# EAGLE design PQ60-EPS (EAGLE 7.2.0)
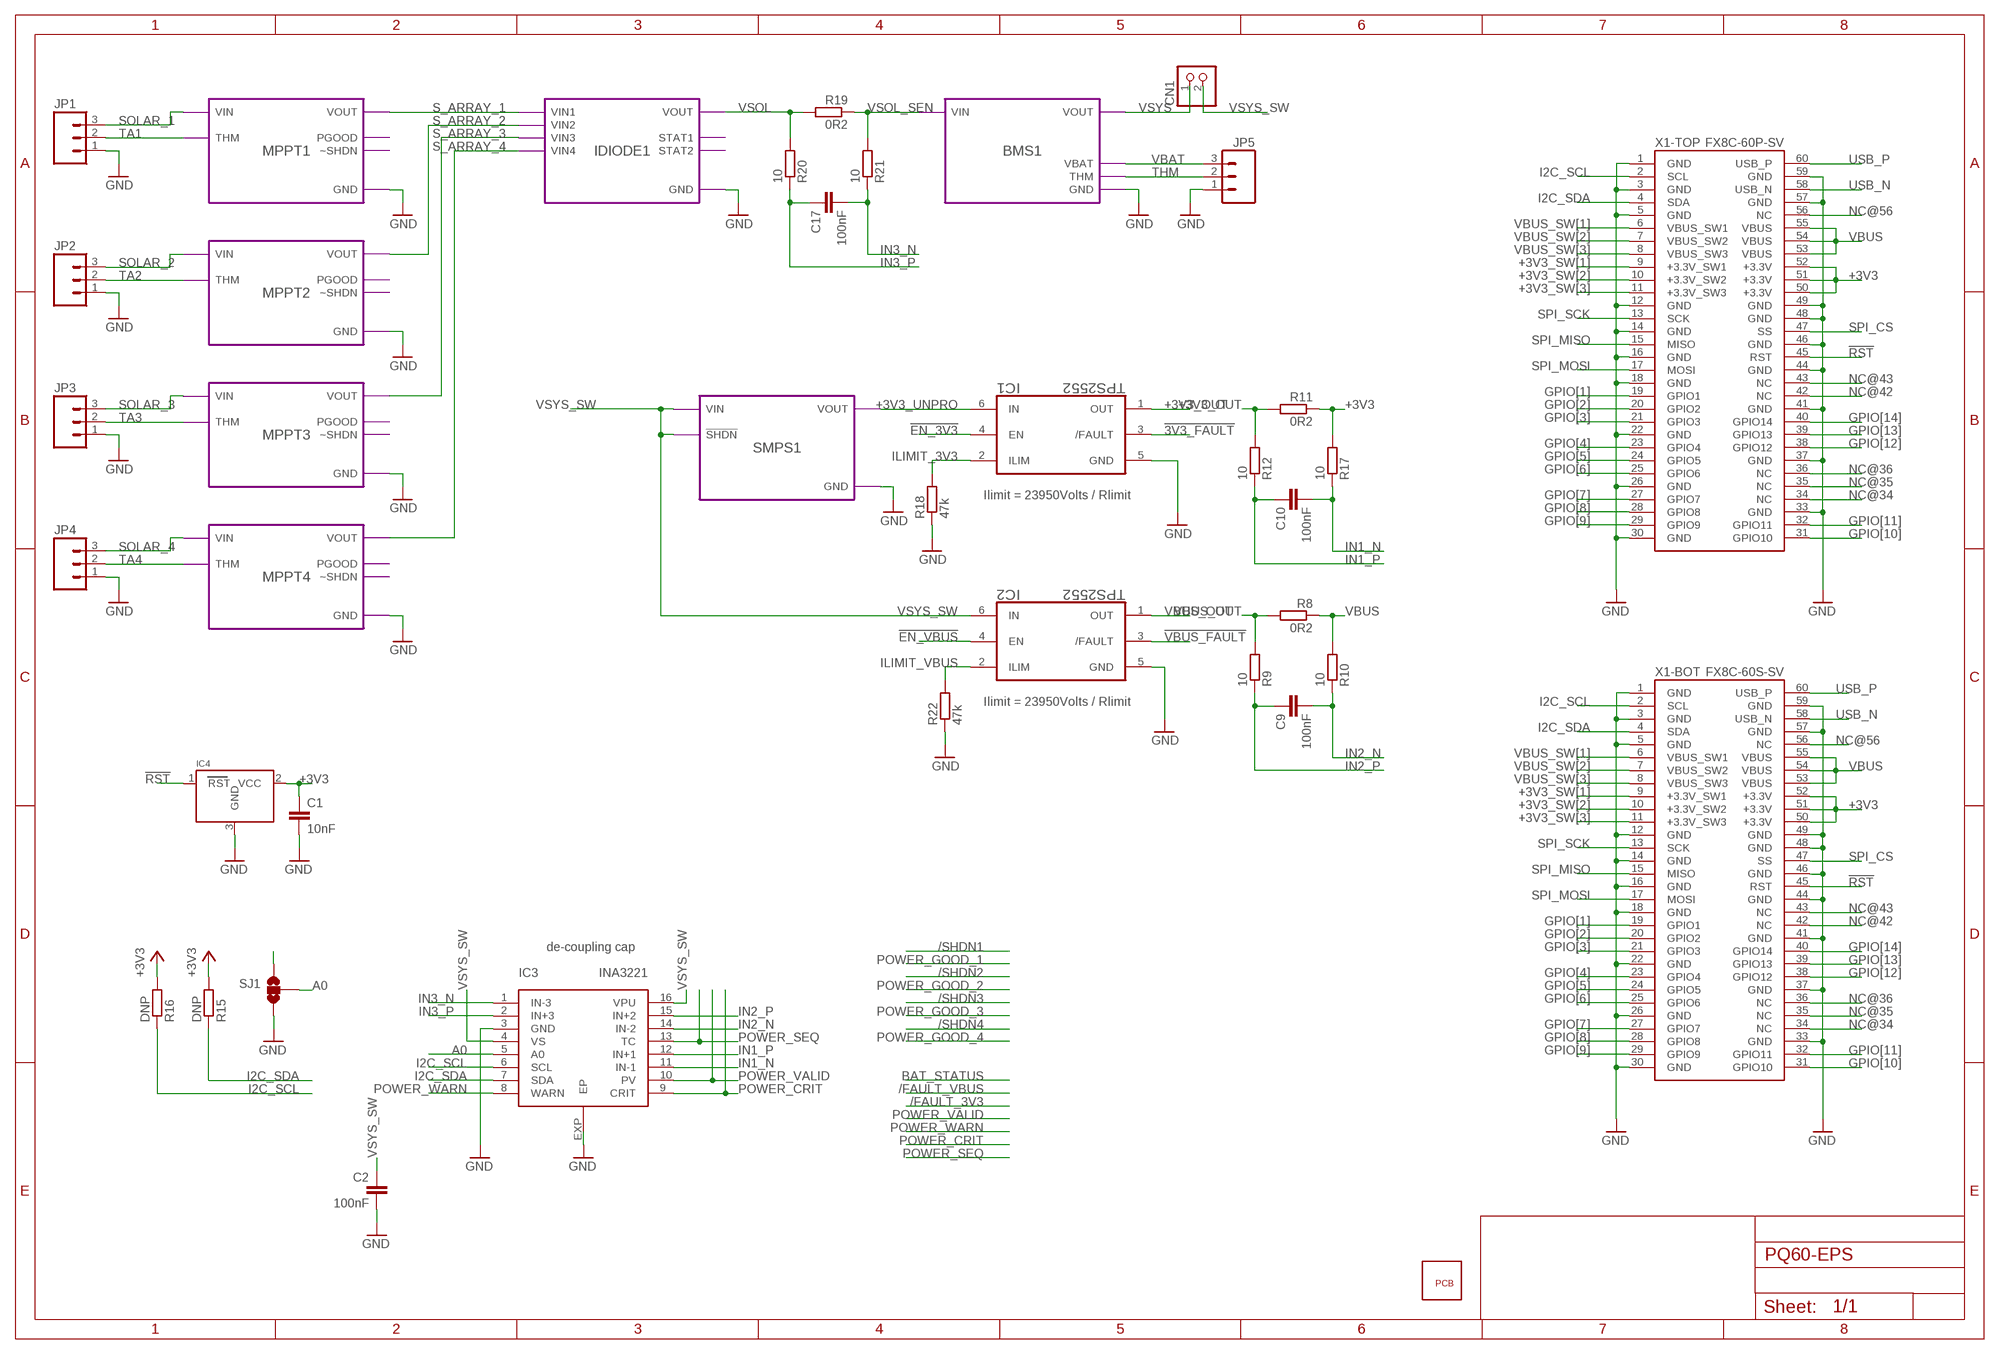
[diagram p0: schematic, sheet 1]

## Parts
B1  PQ60-NOPINS  [PQ60_NOPINS]
C1  10nF  C-EUC0603  [C0603]
C2  100nF  C-EUC0603  [C0603]
C9  100nF  C-EUC0603  [C0603]
C10  100nF  C-EUC0603  [C0603]
C17  100nF  C-EUC0603  [C0603]
CN1  JST_2PINSH2  [JSTSH2]
IC1  TPS2552  TPS2552DBVT  [SOT95P280X145-6N]
IC2  TPS2552  TPS2552DBVT  [SOT95P280X145-6N]
IC3  INA3221  INA3221AIRGV  [QFN16]
IC4  MCP130TREFLOW  [SOT23-R]
JP1  M03SMD  [1X03-1MM-RA]
JP2  M03SMD  [1X03-1MM-RA]
JP3  M03SMD  [1X03-1MM-RA]
JP4  M03SMD  [1X03-1MM-RA]
JP5  M03SMD  [1X03-1MM-RA]
R8  0R2  R-EU_R1206  [R1206]
R9  10  R-EU_R0603  [R0603]
R10  10  R-EU_R0603  [R0603]
R11  0R2  R-EU_R1206  [R1206]
R12  10  R-EU_R0603  [R0603]
R15  DNP  R-EU_R0603  [R0603]
R16  DNP  R-EU_R0603  [R0603]
R17  10  R-EU_R0603  [R0603]
R18  47k  R-EU_R0603  [R0603]
R19  0R2  R-EU_R1206  [R1206]
R20  10  R-EU_R0603  [R0603]
R21  10  R-EU_R0603  [R0603]
R22  47k  R-EU_R0603  [R0603]
SJ1  SOLDERJUMPER_2WAYPASTE2&3  [SJ_3_PASTE2&3]
X1-BOT  FX8C-60S-SV  [FX8C-60S-SV]
X1-TOP  FX8C-60P-SV  [FX8C-60P-SV]

## Module instances
MPPT1 = MPPT
MPPT2 = MPPT
MPPT3 = MPPT
MPPT4 = MPPT
SMPS1 = SMPS
IDIODE1 = IDIODE
BMS1 = BMS

## Nets
!3V3_FAULT: IC1.3(/FAULT)
!EN_3V3: IC1.4(EN)
!EN_VBUS: IC2.4(EN)
!RST: IC4.1(RST) X1-BOT.45(RST) X1-TOP.45(RST)
!VBUS_FAULT: IC2.3(/FAULT)
+3V3: C1.1 IC4.2(VCC) R11.1 R15.2 R16.2 R17.2 X1-BOT.50(+3.3V) X1-BOT.51(+3.3V) X1-BOT.52(+3.3V) X1-TOP.50(+3.3V) X1-TOP.51(+3.3V) X1-TOP.52(+3.3V)
+3V3_OUT: IC1.1(OUT) R11.2 R12.2
+3V3_SW[1]: X1-BOT.9(+3.3V_SW1) X1-TOP.9(+3.3V_SW1)
+3V3_SW[2]: X1-BOT.10(+3.3V_SW2) X1-TOP.10(+3.3V_SW2)
+3V3_SW[3]: X1-BOT.11(+3.3V_SW3) X1-TOP.11(+3.3V_SW3)
+3V3_UNPRO: IC1.6(IN) ; port SMPS1.VOUT
A0: IC3.5(A0) SJ1.2
GND: C1.2 C2.2 IC1.5(GND) IC2.5(GND) IC3.3(GND) IC3.EXP(EP) IC4.3(GND) JP1.1 JP2.1 JP3.1 JP4.1 JP5.1 R18.1 R22.1 SJ1.3 X1-BOT.1(GND) X1-BOT.3(GND) X1-BOT.5(GND) X1-BOT.12(GND) X1-BOT.14(GND) X1-BOT.16(GND) X1-BOT.18(GND) X1-BOT.22(GND) X1-BOT.26(GND) X1-BOT.30(GND) X1-BOT.33(GND) X1-BOT.37(GND) X1-BOT.41(GND) X1-BOT.44(GND) X1-BOT.46(GND) X1-BOT.48(GND) X1-BOT.49(GND) X1-BOT.57(GND) X1-BOT.59(GND) X1-TOP.1(GND) X1-TOP.3(GND) X1-TOP.5(GND) X1-TOP.12(GND) X1-TOP.14(GND) X1-TOP.16(GND) X1-TOP.18(GND) X1-TOP.22(GND) X1-TOP.26(GND) X1-TOP.30(GND) X1-TOP.33(GND) X1-TOP.37(GND) X1-TOP.41(GND) X1-TOP.44(GND) X1-TOP.46(GND) X1-TOP.48(GND) X1-TOP.49(GND) X1-TOP.57(GND) X1-TOP.59(GND) ; port IDIODE1.GND MPPT1.GND MPPT2.GND MPPT3.GND MPPT4.GND SMPS1.GND BMS1.GND
GPIO[1]: X1-BOT.19(GPIO1) X1-TOP.19(GPIO1)
GPIO[2]: X1-BOT.20(GPIO2) X1-TOP.20(GPIO2)
GPIO[3]: X1-BOT.21(GPIO3) X1-TOP.21(GPIO3)
GPIO[4]: X1-BOT.23(GPIO4) X1-TOP.23(GPIO4)
GPIO[5]: X1-BOT.24(GPIO5) X1-TOP.24(GPIO5)
GPIO[6]: X1-BOT.25(GPIO6) X1-TOP.25(GPIO6)
GPIO[7]: X1-BOT.27(GPIO7) X1-TOP.27(GPIO7)
GPIO[8]: X1-BOT.28(GPIO8) X1-TOP.28(GPIO8)
GPIO[9]: X1-BOT.29(GPIO9) X1-TOP.29(GPIO9)
GPIO[10]: X1-BOT.31(GPIO10) X1-TOP.31(GPIO10)
GPIO[11]: X1-BOT.32(GPIO11) X1-TOP.32(GPIO11)
GPIO[12]: X1-BOT.38(GPIO12) X1-TOP.38(GPIO12)
GPIO[13]: X1-BOT.39(GPIO13) X1-TOP.39(GPIO13)
GPIO[14]: X1-BOT.40(GPIO14) X1-TOP.40(GPIO14)
I2C_SCL: IC3.6(SCL) R16.1 X1-BOT.2(SCL) X1-TOP.2(SCL)
I2C_SDA: IC3.7(SDA) R15.1 X1-BOT.4(SDA) X1-TOP.4(SDA)
ILIMIT_3V3: IC1.2(ILIM) R18.2
ILIMIT_VBUS: IC2.2(ILIM) R22.2
IN1_N: C10.2 IC3.11(IN-1) R17.1
IN1_P: C10.1 IC3.12(IN+1) R12.1
IN2_N: C9.2 IC3.14(IN-2) R10.1
IN2_P: C9.1 IC3.15(IN+2) R9.1
IN3_N: C17.2 IC3.1(IN-3) R21.1
IN3_P: C17.1 IC3.2(IN+3) R20.1
NC@34: X1-BOT.34(NC) X1-TOP.34(NC)
NC@35: X1-BOT.35(NC) X1-TOP.35(NC)
NC@36: X1-BOT.36(NC) X1-TOP.36(NC)
NC@42: X1-BOT.42(NC) X1-TOP.42(NC)
NC@43: X1-BOT.43(NC) X1-TOP.43(NC)
NC@56: X1-BOT.56(NC) X1-TOP.56(NC)
POWER_CRIT: IC3.9(CRIT)
POWER_SEQ: IC3.13(TC)
POWER_VALID: IC3.10(PV)
POWER_WARN: IC3.8(WARN)
S_ARRAY_1: port IDIODE1.VIN1 MPPT1.VOUT
S_ARRAY_2: port IDIODE1.VIN2 MPPT2.VOUT
S_ARRAY_3: port IDIODE1.VIN3 MPPT3.VOUT
S_ARRAY_4: port IDIODE1.VIN4 MPPT4.VOUT
SOLAR_1: JP1.3 ; port MPPT1.VIN
SOLAR_2: JP2.3 ; port MPPT2.VIN
SOLAR_3: JP3.3 ; port MPPT3.VIN
SOLAR_4: JP4.3 ; port MPPT4.VIN
SPI_CS: X1-BOT.47(SS) X1-TOP.47(SS)
SPI_MISO: X1-BOT.15(MISO) X1-TOP.15(MISO)
SPI_MOSI: X1-BOT.17(MOSI) X1-TOP.17(MOSI)
SPI_SCK: X1-BOT.13(SCK) X1-TOP.13(SCK)
TA1: JP1.2 ; port MPPT1.THM
TA2: JP2.2 ; port MPPT2.THM
TA3: JP3.2 ; port MPPT3.THM
TA4: JP4.2 ; port MPPT4.THM
THM: JP5.2 ; port BMS1.THM
USB_N: X1-BOT.58(USB_N) X1-TOP.58(USB_N)
USB_P: X1-BOT.60(USB_P) X1-TOP.60(USB_P)
VBAT: JP5.3 ; port BMS1.VBAT
VBUS: R8.1 R10.2 X1-BOT.53(VBUS) X1-BOT.54(VBUS) X1-BOT.55(VBUS) X1-TOP.53(VBUS) X1-TOP.54(VBUS) X1-TOP.55(VBUS)
VBUS_OUT: IC2.1(OUT) R8.2 R9.2
VBUS_SW[1]: X1-BOT.6(VBUS_SW1) X1-TOP.6(VBUS_SW1)
VBUS_SW[2]: X1-BOT.7(VBUS_SW2) X1-TOP.7(VBUS_SW2)
VBUS_SW[3]: X1-BOT.8(VBUS_SW3) X1-TOP.8(VBUS_SW3)
VSOL: R19.2 R20.2 ; port IDIODE1.VOUT
VSOL_SEN: R19.1 R21.2 ; port BMS1.VIN
VSYS: CN1.1 ; port BMS1.VOUT
VSYS_SW: C2.1 CN1.2 IC2.6(IN) IC3.4(VS) IC3.16(VPU) SJ1.1 ; port SMPS1.VIN SMPS1.!SHDN

## Notes on the sheet
- Ilimit = 23950Volts / Rlimit
- Ilimit = 23950Volts / Rlimit
- de-coupling cap

## Library data of the parts
B1 = general:PQ60-NOPINS
C1 C2 C9 C10 C17 = rcl:C-EU: CAPACITOR, European symbol; OC_FARNELL: unknown
CN1 = microbuilder:JST_2PIN: JST 2-Pin Right-Angle Connector PH-Series - 4UConnector: 17311 SH-Series - 4UConnector: 07278
IC1 IC2 = general:TPS2552DBVT: Precision adjustable current-limited power-distribution switch; MPN: TPS2552DBVT; OC_FARNELL: 1694421; OC_NEWARK: 40P3866; PACKAGE: SOT-23-6; SUPPLIER: Texas Instruments
IC3 = general:INA3221AIRGV: The INA3221 is a three-channel, high-side current and bus voltage monitor with an I2C interface. The INA3221 monitors both shunt voltage drops and bus supply voltages in addition to having programmable conversion times and averaging modes for these signals. The INA3221 offers both critical and warning alerts to detect multiple programmable out-of-range conditions for each channel.; MF: TEXAS INSTRUMENTS; MPN: INA3221AIRGVT; OC_FARNELL: 2144251
IC4 = microbuilder:MCP130T: MCP130T Voltage Supervisor (Active Low) Voltage supervisors will put the MCU in a reset state if the voltage drops below a pre-determined level. SOT23-R/SOT23-W: Voltage Supervisor - 3.15V Active Low Note: Use the "Reflow" footprint when working with solder paste, and the "Wave" footprint when soldering by hand with a soldering iron (the latter has larger pads that are easier to solder by hand). Digikey: MCP130T-315I/TTCT-ND
JP1-JP5 = SparkFun-Connectors:M03: Header 3 Standard 3-pin 0.1" header. Use with straight break away headers (SKU : PRT-00116), right angle break away headers (PRT-00553), swiss pins (PRT-00743), machine pins (PRT-00117), and female headers (PRT-00115). Molex polarized connector foot print use with SKU : PRT-08232 with associated crimp pins and housings.
R8-R12 R15-R22 = rcl:R-EU_: RESISTOR, European symbol; OC_FARNELL: unknown
SJ1 = SparkFun-Retired:SOLDERJUMPER_2WAY: Solder Jumper 2 way solder jumper
X1-BOT X1-TOP = PQ60:FX8C-60

## Module MPPT
Ports: GND(pwr) VOUT(out) VIN(in) THM(in) PGOOD(out) ~SHDN(in)
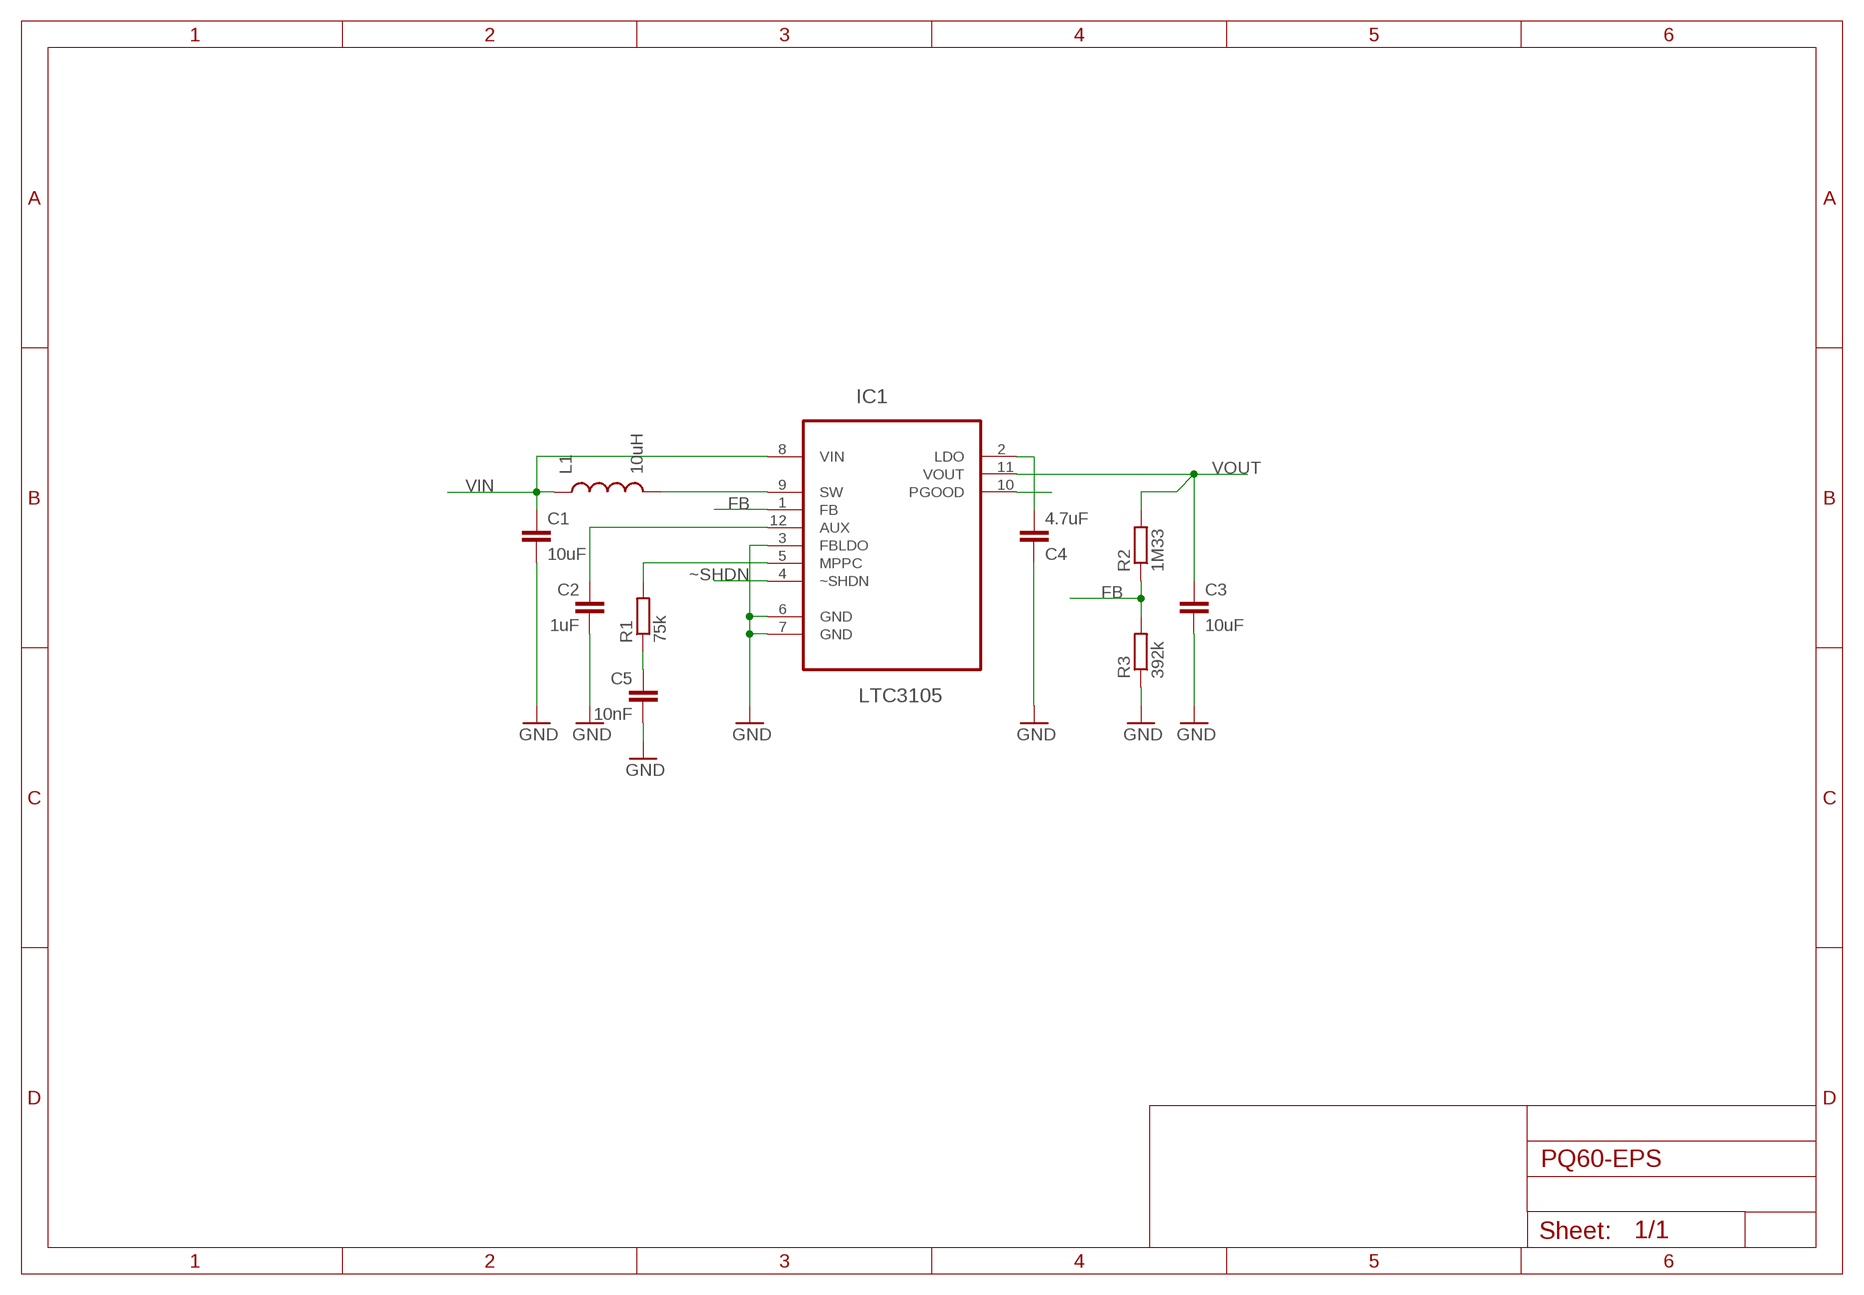
[diagram p1: schematic, module MPPT, sheet 1]

### Parts
C1  10uF  C-EUC0805  [C0805]
C2  1uF  C-EUC0603  [C0603]
C3  10uF  C-EUC0805  [C0805]
C4  4.7uF  C-EUC0603  [C0603]
C5  10nF  C-EUC0603  [C0603]
IC1  LTC3105  LTC3105EMSPBF  [SOP65P490X110-12N]
L1  10uH  INDUCTOR-  [CDRH3D28]
R1  75k  R-EU_R0603  [R0603]
R2  1M33  R-EU_R0603  [R0603]
R3  392k  R-EU_R0603  [R0603]

### Nets
AUX: C2.1 IC1.12(AUX)
FB: IC1.1(FB) R2.1 R3.2
GND: C1.2 C2.2 C3.2 C4.1 C5.2 IC1.3(FBLDO) IC1.6(GND) IC1.7(GND) R3.1
LDO: C4.2 IC1.2(LDO)
MPPC: IC1.5(MPPC) R1.2
PGOOD: IC1.10(PGOOD)
SW: IC1.9(SW) L1.2
THM: C5.1 R1.1
VIN: C1.1 IC1.8(VIN) L1.1
VOUT: C3.1 IC1.11(VOUT) R2.2
~SHDN: IC1.4(~SHDN)

### Library data of the parts
C1 C3 C4 = rcl:C-EU: CAPACITOR, European symbol; OC_FARNELL: unknown
C2 C5 = rcl:C-EU: CAPACITOR, European symbol; MF: AVX; MPN: 02016D105MAT2A; OC_FARNELL: 1867951RL
IC1 = general:LTC3105EMSPBF: DC/DC Converter; MF: LINEAR TECHNOLOGY; MPN: LTC3105EMS#PBF; OC_FARNELL: 1898601; OC_NEWARK: 27T5811; PACKAGE: MSOP-12; SUPPLIER: Linear Technology
L1 = SparkFun march 2012:INDUCTOR: Inductors; OC_FARNELL: unknown
R1-R3 = rcl:R-EU_: RESISTOR, European symbol; OC_FARNELL: unknown

## Module SMPS
Ports: VIN(in) VOUT(out) GND(pwr) !SHDN(in)
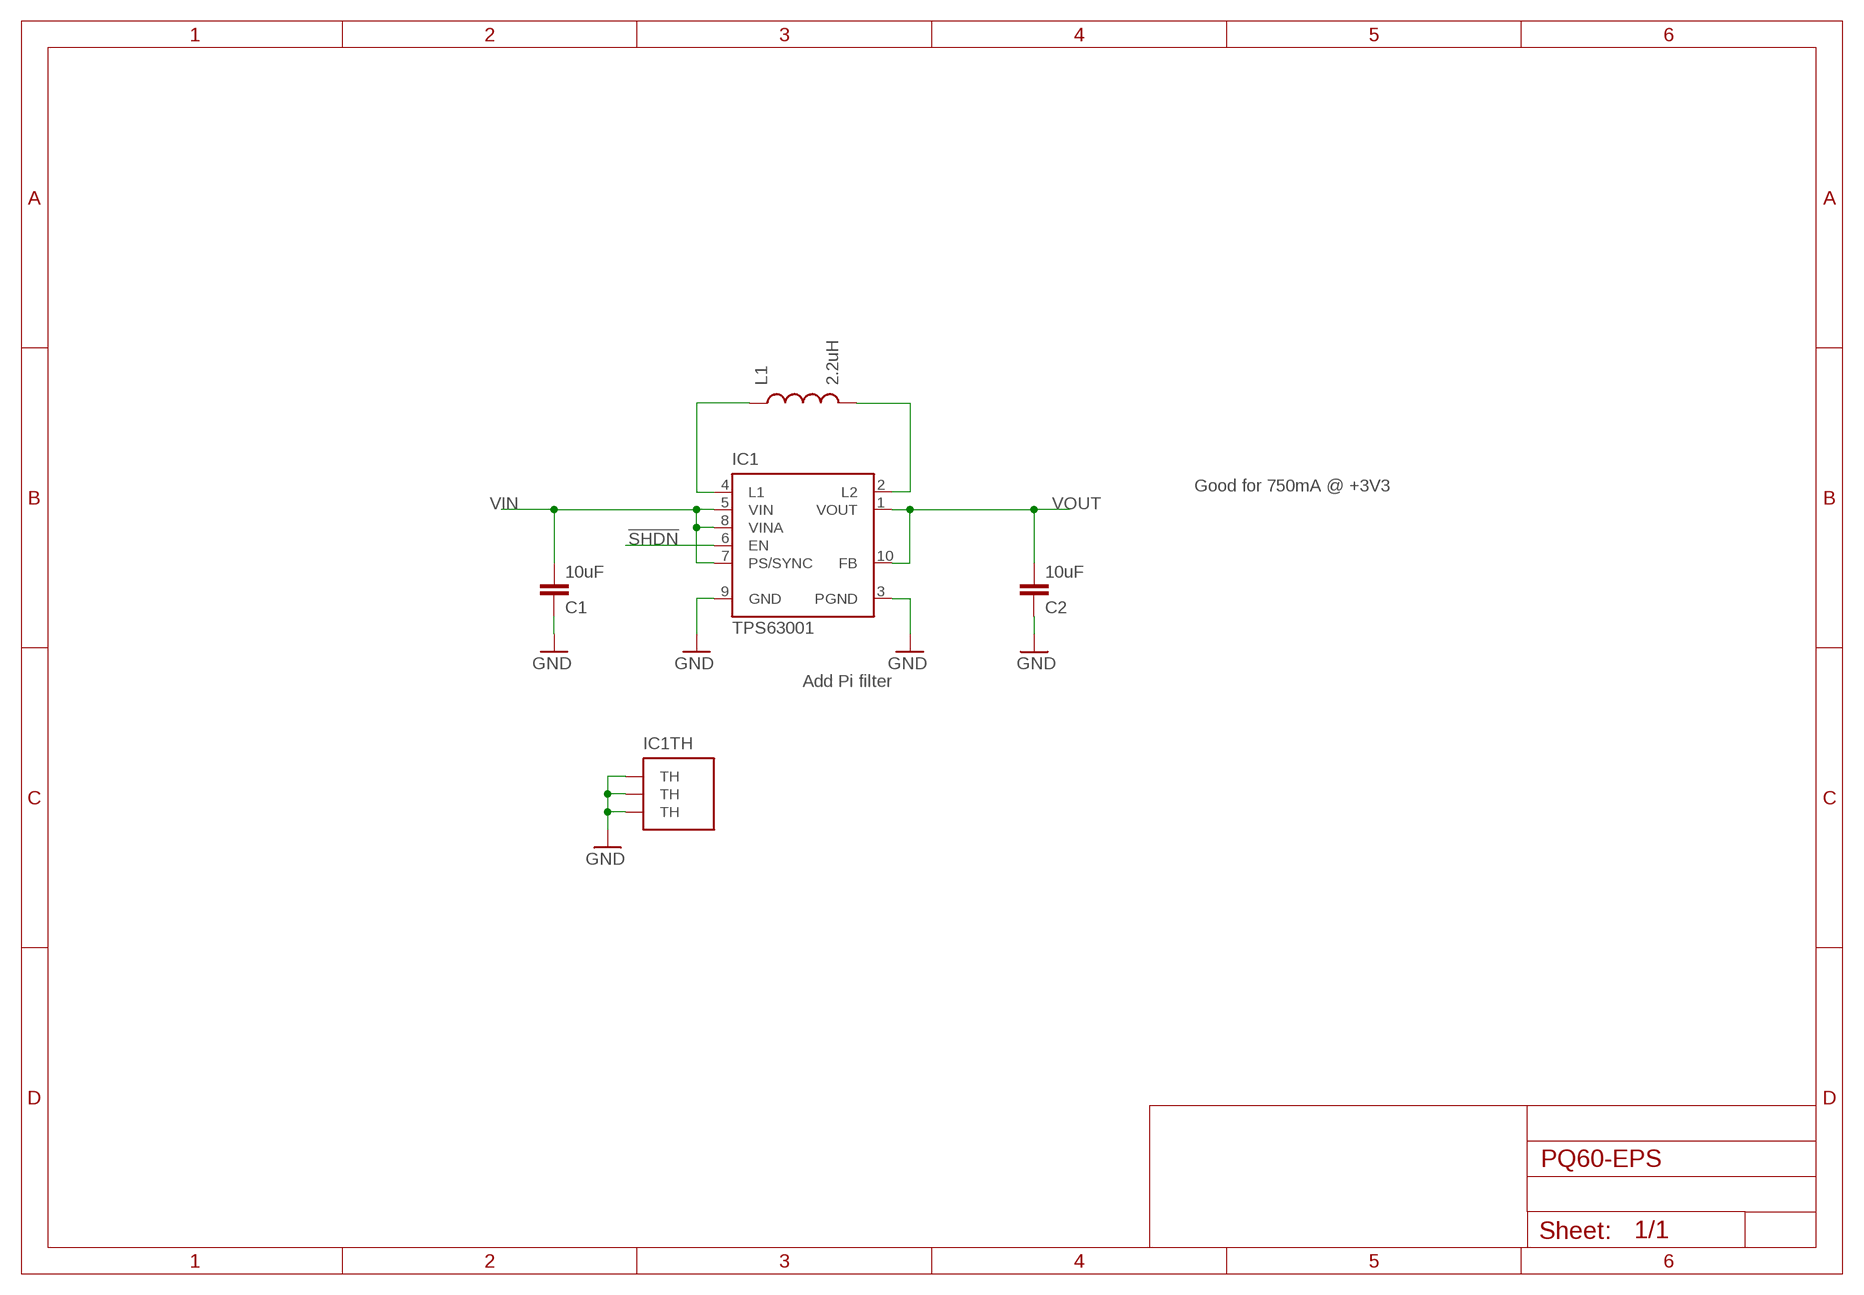
[diagram p2: schematic, module SMPS, sheet 1]

### Parts
C1  10uF  C-EUC0805  [C0805]
C2  10uF  C-EUC0805  [C0805]
IC1  TPS63001  TPS6300  [DRC-S-PVSON-N10]
L1  2.2uH  INDUCTORVLF4012A  [VLF4012A]

### Nets
!SHDN: IC1.6(EN)
GND: C1.1 C2.1 IC1.3(PGND) IC1.9(GND) IC1.TH IC1.TH@1(TH) IC1.TH@2(TH)
N$1: IC1.4(L1) L1.P$1
N$2: IC1.2(L2) L1.P$2
VIN: C1.2 IC1.5(VIN) IC1.7(PS/SYNC) IC1.8(VINA)
VOUT: C2.2 IC1.1(VOUT) IC1.10(FB)

### Notes on the sheet
- Good for 750mA @ +3V3
- Add Pi filter

### Library data of the parts
C1 C2 = rcl:C-EU: CAPACITOR, European symbol; OC_FARNELL: unknown
IC1 = texas:TPS6300*: HIGH EFFICIENT SINGLE INDUCTOR BUCK-BOOST CONVERTER WITH 1.8-A SWITCHES Source: http://focus.ti.com/lit/ds/symlink/tps63001.pdf
L1 = SparkFun-Passives:INDUCTOR: Inductors

## Module IDIODE
Ports: GND(pwr) VOUT(out) STAT1(out) STAT2(out) VIN1(in) VIN2(in) VIN3(in) VIN4(in)
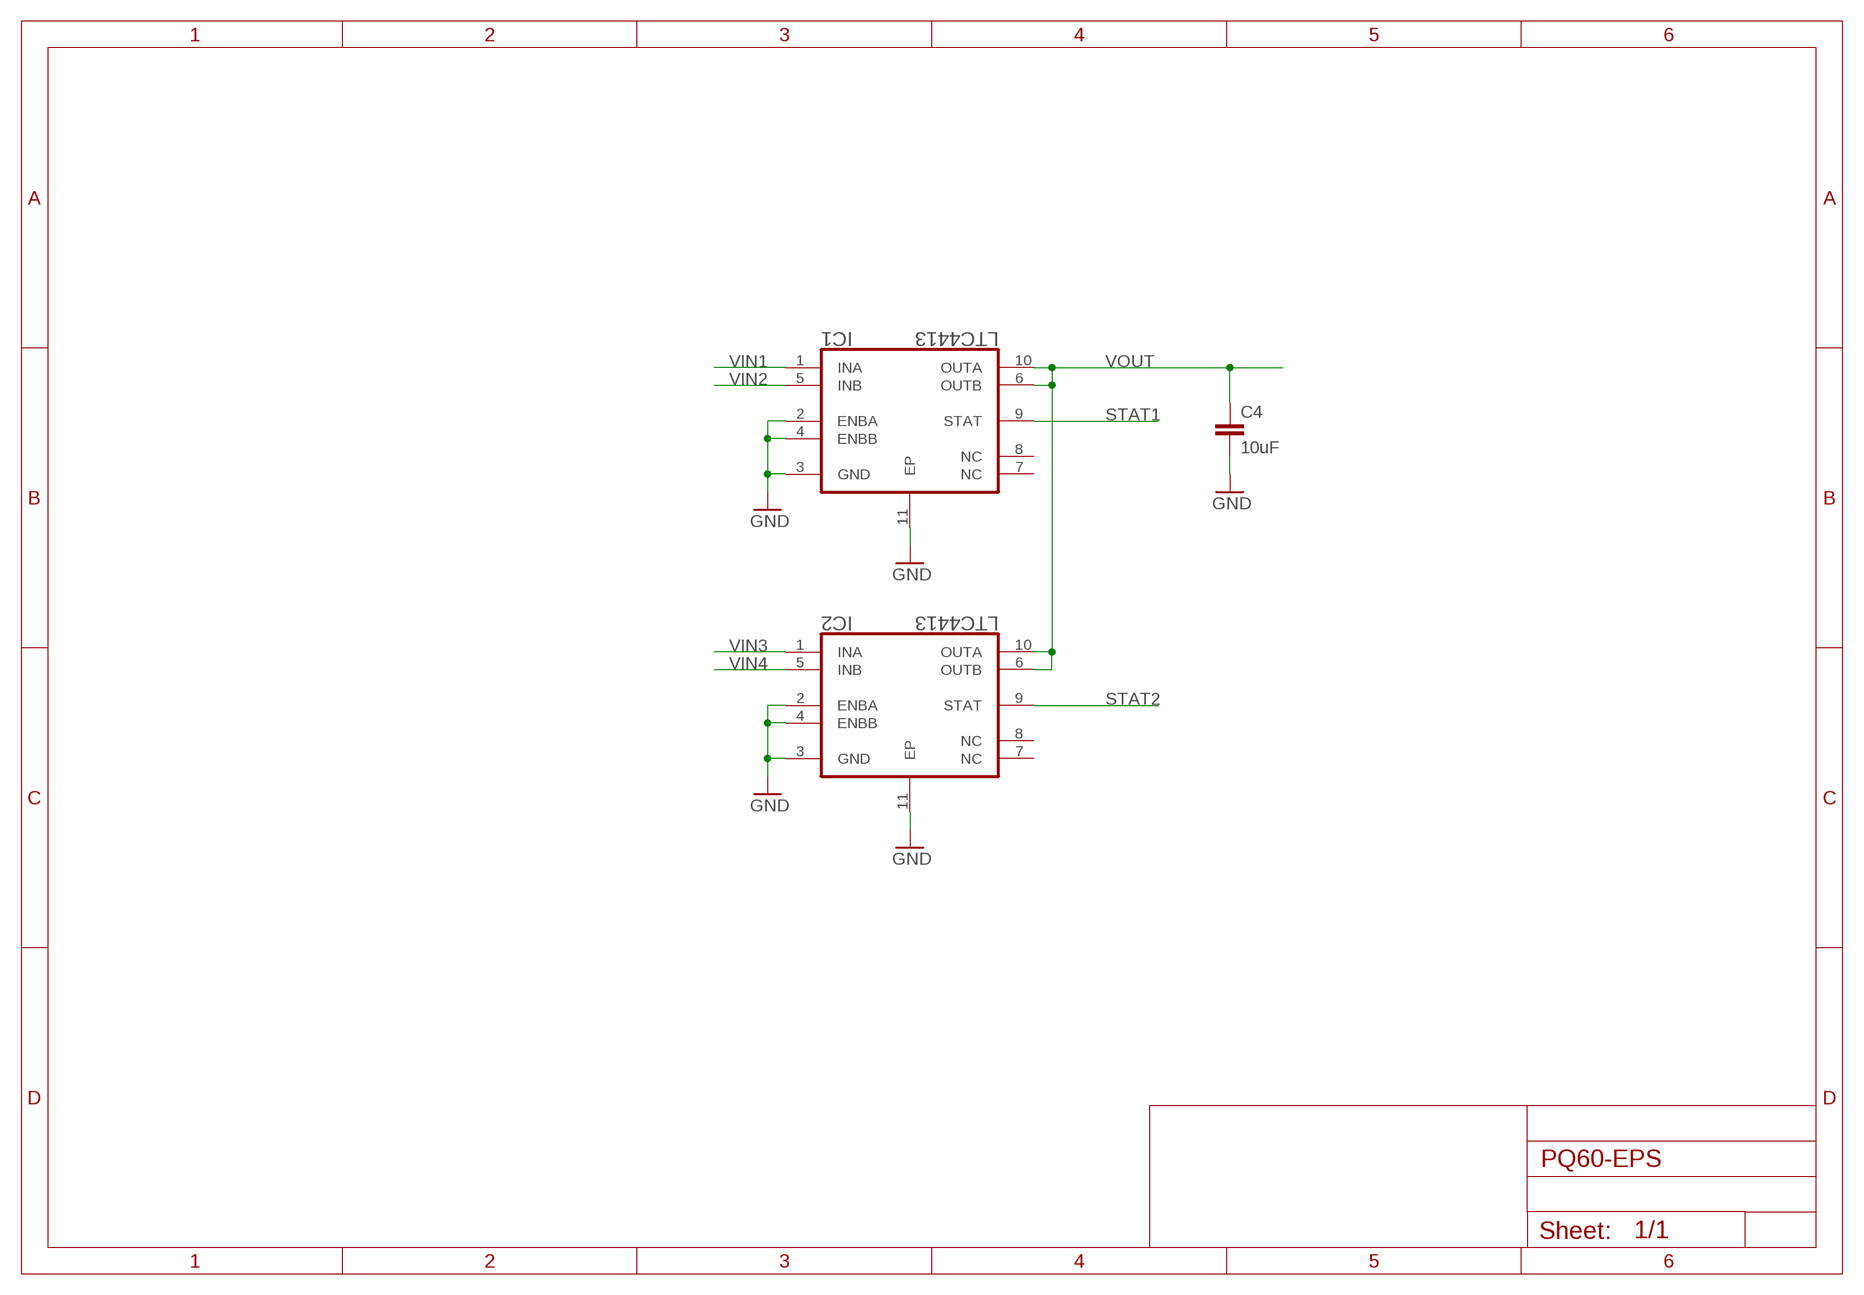
[diagram p3: schematic, module IDIODE, sheet 1]

### Parts
C4  10uF  C-EUC0805  [C0805]
IC1  LTC4413  LTC4413EDDPBF  [DFN300X300X80-11N]
IC2  LTC4413  LTC4413EDDPBF  [DFN300X300X80-11N]

### Nets
GND: C4.2 IC1.2(ENBA) IC1.3(GND) IC1.4(ENBB) IC1.11(EP) IC2.2(ENBA) IC2.3(GND) IC2.4(ENBB) IC2.11(EP)
STAT1: IC1.9(STAT)
STAT2: IC2.9(STAT)
VIN1: IC1.1(INA)
VIN2: IC1.5(INB)
VIN3: IC2.1(INA)
VIN4: IC2.5(INB)
VOUT: C4.1 IC1.6(OUTB) IC1.10(OUTA) IC2.6(OUTB) IC2.10(OUTA)
Unconnected: IC1.7(NC) IC1.8(NC) IC2.7(NC) IC2.8(NC)

### Library data of the parts
C4 = rcl:C-EU: CAPACITOR, European symbol; OC_FARNELL: unknown
IC1 IC2 = general:LTC4413EDDPBF: Dual 2.6A, 2.5V to 5.5V, Ideal Diodes; MPN: LTC4413EDD#PBF; OC_FARNELL: 1663736; OC_NEWARK: 56M9529; PACKAGE: DFN-10; SUPPLIER: Linear Technology

## Module BMS
Ports: GND(pwr) VIN(in) VOUT(out) VBAT(out) THM(in)
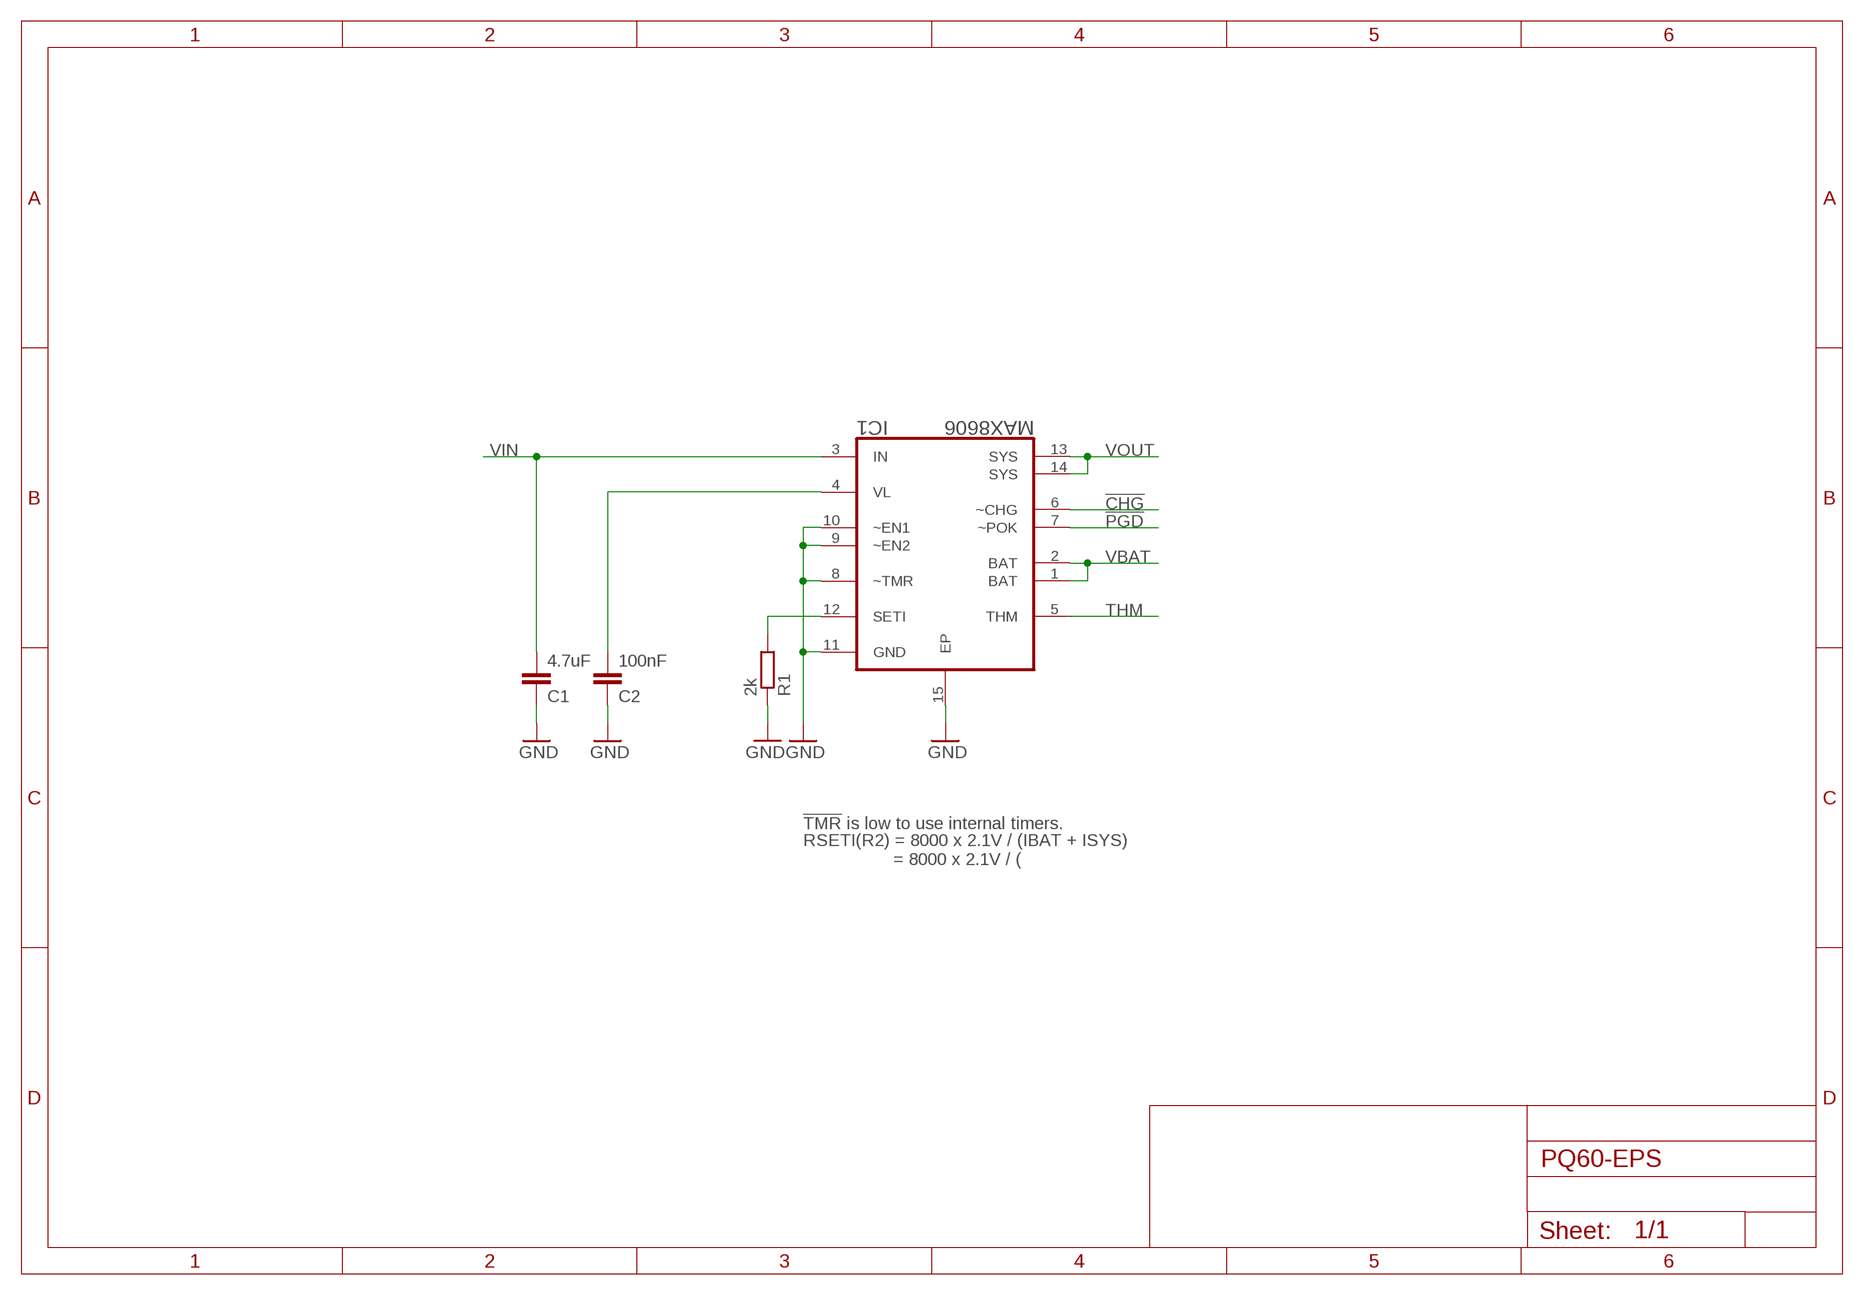
[diagram p4: schematic, module BMS, sheet 1]

### Parts
C1  4.7uF  C-EUC0603  [C0603]
C2  100nF  C-EUC0603  [C0603]
IC1  MAX8606  MAX8606ETD+T  [DFN300X300X80-15N]
R1  2k  R-EU_R0603  [R0603]

### Nets
!CHG: IC1.6(~CHG)
!PGD: IC1.7(~POK)
BATT_PROG: IC1.12(SETI) R1.2
GND: C1.1 C2.1 IC1.8(~TMR) IC1.9(~EN2) IC1.10(~EN1) IC1.11(GND) IC1.15(EP) R1.1
THM: IC1.5(THM)
VBAT: IC1.1(BAT) IC1.2(BAT)
VIN: C1.2 IC1.3(IN)
VL: C2.2 IC1.4(VL)
VOUT: IC1.13(SYS) IC1.14(SYS)

### Notes on the sheet
- !TMR! is low to use internal timers.
- RSETI(R2) = 8000 x 2.1V / (IBAT + ISYS)
                    = 8000 x 2.1V / (

### Library data of the parts
C1 C2 = rcl:C-EU: CAPACITOR, European symbol; OC_FARNELL: unknown
IC1 = general:MAX8606ETD+T: USB/AC Adapter, Li+ Linear Battery Charger with Integrated 50mÙ Battery Switch; MPN: MAX8606ETD+T; OC_FARNELL: 1628234; OC_NEWARK: 68K5050; PACKAGE: DFN-14; SUPPLIER: Maxim
R1 = rcl:R-EU_: RESISTOR, European symbol; OC_FARNELL: unknown

## Board
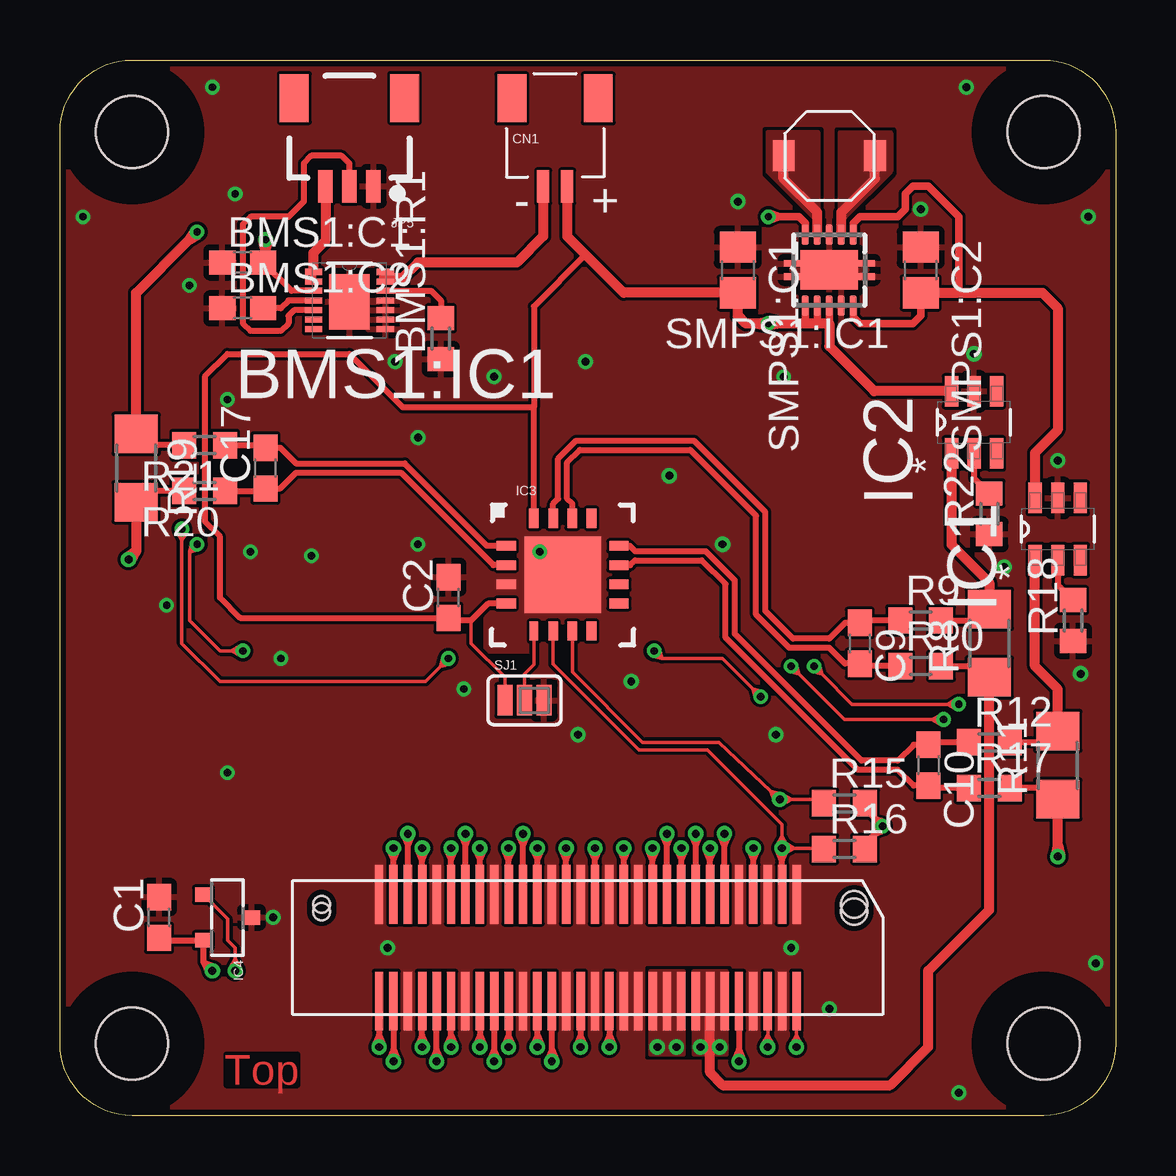
[diagram p5: board, top side]
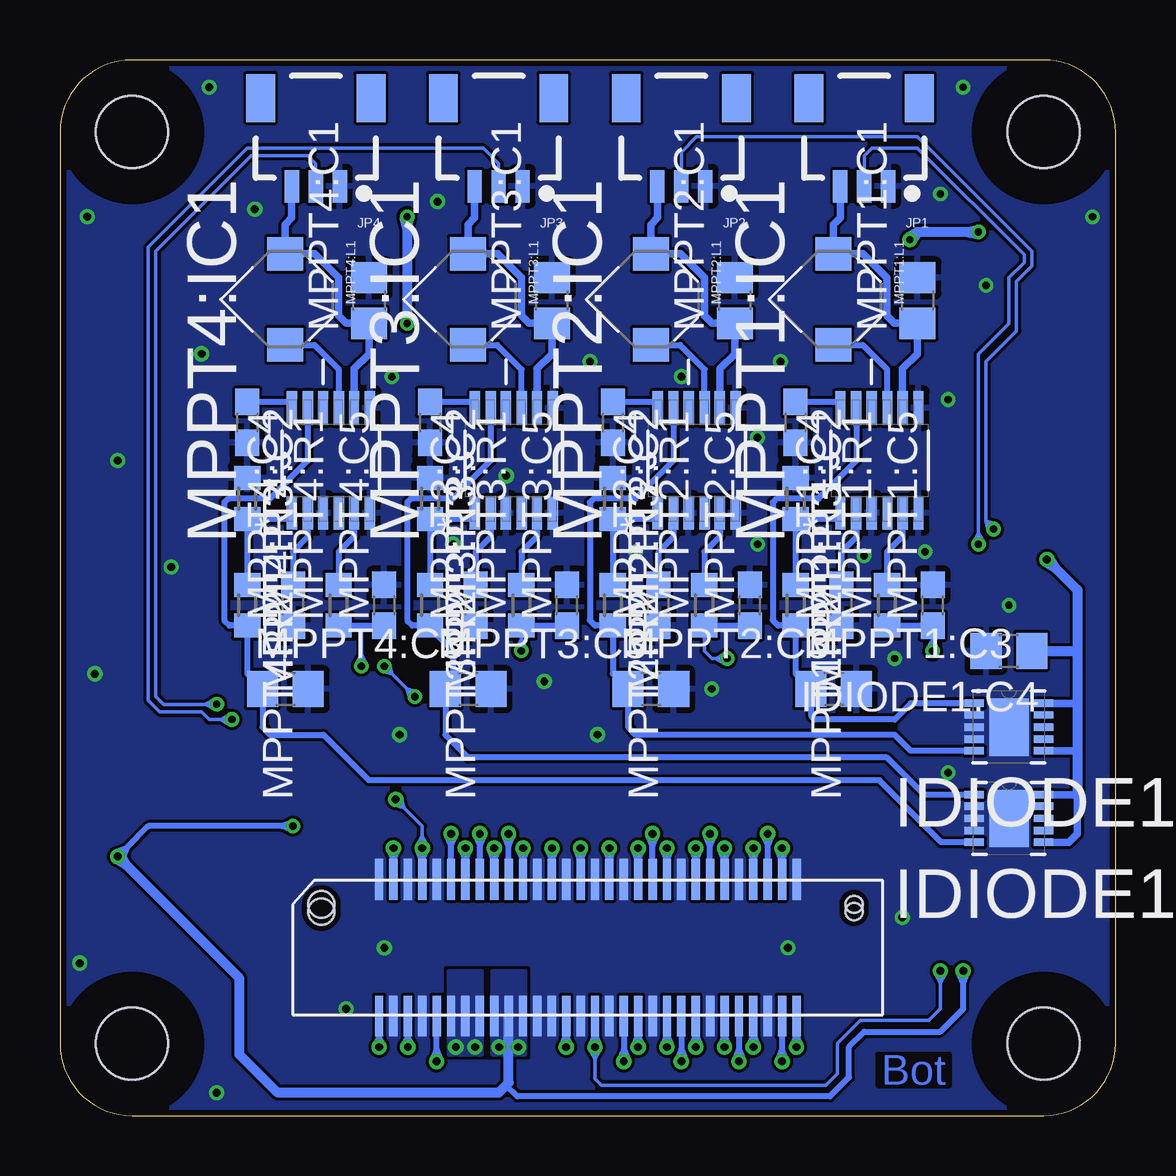
[diagram p6: board, bottom side, seen from below]

Size 44 x 44 mm. Coordinates in mm from the lower left corner, seen from the top.
Copper layers (1*16): Top 0.035mm / dielectric 1.5mm / Bottom 0.035mm
Design rules "dirt_cheap_dirty_boards.v1": minimum track width 5mil, minimum drill 12mil, track to track 5mil, track to pad 5mil, pad to pad 5mil, via to via 5mil, smd to smd 0mil, copper to edge 10mil, drill to drill 10mil, minimum pad ring 10mil, minimum via ring 6mil, stop-mask expansion 2mil, vias tented up to drill 25mil, thermal gap 10mil

### Footprints (pad centres in the part's own frame; a part is rotated, then mirrored left to right if it is on the bottom)
PQ60_NOPINS = hole 3: 3,3; 3,41; 41,41; 41,3
C0603 = smd 1.1 x 1: 1 -0.85,0; 2 0.85,0
DFN300X300X80-15N = smd 0.711 x 0.254: 1 -1.499,1.194; 2 -1.499,0.787; 3 -1.499,0.406; 4 -1.499,0; 5 -1.499,-0.406; 6 -1.499,-0.787; 7 -1.499,-1.194; 8 1.499,-1.194; 9 1.499,-0.787; 10 1.499,-0.406; 11 1.499,0; 12 1.499,0.406; 13 1.499,0.787; 14 1.499,1.194 | smd 1.702 x 2.311: 15 0,-0.051
R0603 = smd 1 x 1.1: 1 -0.85,0; 2 0.85,0
JSTSH2 = smd 0.5 x 1.35: 1 -0.5,-2.55; 2 0.5,-2.55 | smd 1.2 x 2: NC1 -1.8,1.125; NC2 1.8,1.125
SOT95P280X145-6N = smd 1.27 x 0.559: 1 -1.295,0.94; 2 -1.295,0; 3 -1.295,-0.94; 4 1.295,-0.94; 5 1.295,0; 6 1.295,0.94
QFN16 = smd 0.8 x 0.4: 1 -2.35,1.2; 2 -2.35,0.4; 3 -2.35,-0.4; 4 -2.35,-1.2; 9 2.35,-1.2; 10 2.35,-0.4; 11 2.35,0.4; 12 2.35,1.2 | smd 0.35 x 0.8: 5 -1.2,-2.35 | smd 0.4 x 0.8: 6 -0.4,-2.35; 7 0.4,-2.35; 8 1.2,-2.35; 13 1.2,2.35; 14 0.4,2.35; 15 -0.4,2.35; 16 -1.2,2.35 | smd 3.19 x 3.19: EXP 0,0
SOT23-R = smd 0.6 x 0.7: 1 -0.95,-1; 2 0.95,-1; 3 0,1
C0805 = smd 1.3 x 1.5: 1 -0.95,0; 2 0.95,0
DFN300X300X80-11N = smd 0.813 x 0.305: 1 -1.448,0.991; 2 -1.448,0.508; 3 -1.448,0; 4 -1.448,-0.508; 5 -1.448,-0.991; 6 1.448,-0.991; 7 1.448,-0.508; 8 1.448,0; 9 1.448,0.508; 10 1.448,0.991 | smd 1.651 x 2.388: 11 0,0
1X03-1MM-RA = smd 0.6 x 1.35: 1 -1,0; 2 0,0; 3 1,0 | smd 1.2 x 2: NC1 2.3,-3.675; NC2 -2.3,-3.675
SOP65P490X110-12N = smd 1.397 x 0.432: 1 -2.184,1.626; 2 -2.184,0.965; 3 -2.184,0.33; 4 -2.184,-0.33; 5 -2.184,-0.965; 6 -2.184,-1.626; 7 2.184,-1.626; 8 2.184,-0.965; 9 2.184,-0.33; 10 2.184,0.33; 11 2.184,0.965; 12 2.184,1.626
CDRH3D28 = smd 1.4 x 1.5: 1 -1.95,-0.007; 2 1.849,-0.007
R1206 = smd 1.6 x 1.803: 1 -1.422,0; 2 1.422,0
SJ_3_PASTE2&3 = smd 0.635 x 1.27: 1 -0.813,0; 2 0,0; 3 0.813,0
DRC-S-PVSON-N10 = smd 0.28 x 0.85: 1 -1,-1.475; 2 -0.5,-1.475; 3 0,-1.475; 4 0.5,-1.475; 5 1,-1.475; 6 1,1.475; 7 0.5,1.475; 8 0,1.475; 9 -0.5,1.475; 10 -1,1.475 | smd 2.4 x 1.65: TH 0,0 | smd 3.8 x 0.28: TH@1 0,0.275; TH@2 0,-0.275
VLF4012A = smd 0.9 x 1.3: P$1 -1.9,0; P$2 1.9,0
FX8C-60S-SV = smd 0.35 x 1.7: 1 -8.7,2.85; 2 -8.1,2.85; 3 -7.5,2.85; 4 -6.9,2.85; 5 -6.3,2.85; 6 -5.7,2.85; 7 -5.1,2.85; 8 -4.5,2.85; 9 -3.9,2.85; 10 -3.3,2.85; 11 -2.7,2.85; 12 -2.1,2.85; 13 -1.5,2.85; 14 -0.9,2.85; 15 -0.3,2.85; 16 0.3,2.85; 17 0.9,2.85; 18 1.5,2.85; 19 2.1,2.85; 20 2.7,2.85; 21 3.3,2.85; 22 3.9,2.85; 23 4.5,2.85; 24 5.1,2.85; 25 5.7,2.85; 26 6.3,2.85; 27 6.9,2.85; 28 7.5,2.85; 29 8.1,2.85; 30 8.7,2.85; 31 8.7,-2.85; 32 8.1,-2.85; 33 7.5,-2.85; 34 6.9,-2.85; 35 6.3,-2.85; 36 5.7,-2.85; 37 5.1,-2.85; 38 4.5,-2.85; 39 3.9,-2.85; 40 3.3,-2.85; 41 2.7,-2.85; 42 2.1,-2.85; 43 1.5,-2.85; 44 0.9,-2.85; 45 0.3,-2.85; 46 -0.3,-2.85; 47 -0.9,-2.85; 48 -1.5,-2.85; 49 -2.1,-2.85; 50 -2.7,-2.85; 51 -3.3,-2.85; 52 -3.9,-2.85; 53 -4.5,-2.85; 54 -5.1,-2.85; 55 -5.7,-2.85; 56 -6.3,-2.85; 57 -6.9,-2.85; 58 -7.5,-2.85; 59 -8.1,-2.85; 60 -8.7,-2.85 | hole 1.1: -11.1,1.8 | hole 0.7: 11.1,1.8
FX8C-60P-SV = smd 0.35 x 2.45: 1 -8.7,-2.225; 2 -8.1,-2.225; 3 -7.5,-2.225; 4 -6.9,-2.225; 5 -6.3,-2.225; 6 -5.7,-2.225; 7 -5.1,-2.225; 8 -4.5,-2.225; 9 -3.9,-2.225; 10 -3.3,-2.225; 11 -2.7,-2.225; 12 -2.1,-2.225; 13 -1.5,-2.225; 14 -0.9,-2.225; 15 -0.3,-2.225; 16 0.3,-2.225; 17 0.9,-2.225; 18 1.5,-2.225; 19 2.1,-2.225; 20 2.7,-2.225; 21 3.3,-2.225; 22 3.9,-2.225; 23 4.5,-2.225; 24 5.1,-2.225; 25 5.7,-2.225; 26 6.3,-2.225; 27 6.9,-2.225; 28 7.5,-2.225; 29 8.1,-2.225; 30 8.7,-2.225; 31 8.7,2.225; 32 8.1,2.225; 33 7.5,2.225; 34 6.9,2.225; 35 6.3,2.225; 36 5.7,2.225; 37 5.1,2.225; 38 4.5,2.225; 39 3.9,2.225; 40 3.3,2.225; 41 2.7,2.225; 42 2.1,2.225; 43 1.5,2.225; 44 0.9,2.225; 45 0.3,2.225; 46 -0.3,2.225; 47 -0.9,2.225; 48 -1.5,2.225; 49 -2.1,2.225; 50 -2.7,2.225; 51 -3.3,2.225; 52 -3.9,2.225; 53 -4.5,2.225; 54 -5.1,2.225; 55 -5.7,2.225; 56 -6.3,2.225; 57 -6.9,2.225; 58 -7.5,2.225; 59 -8.1,2.225; 60 -8.7,2.225 | hole 1.1: -11.1,-1.5 | hole 0.7: 11.1,-1.5

### Placement (x,y rotation side)
B1  0,0 0 top
BMS1:C1  4.7uF  [C0603]  7.62,35.56 0 top
BMS1:C2  100nF  [C0603]  7.62,33.66 0 top
BMS1:IC1  MAX8606  [DFN300X300X80-15N]  12.06,33.97 0 top
BMS1:R1  2k  [R0603]  15.88,32.38 90 top
C1  4.13,8.26 90 top
C2  16.19,21.59 90 top
C9  33.34,19.68 270 top
C10  36.2,14.61 270 top
C17  8.57,26.99 90 top
CN1  20.64,41.27 0 top
IC1  41.59,24.45 90 top
IC2  38.1,28.89 90 top
IC3  20.95,22.54 0 top
IC4  6.99,8.26 270 top
IDIODE1:C4  10uF  [C0805]  4.45,19.37 180 bottom
IDIODE1:IC1  LTC4413  [DFN300X300X80-11N]  4.45,16.19 0 bottom
IDIODE1:IC2  LTC4413  [DFN300X300X80-11N]  4.45,12.38 0 bottom
JP1  10.48,38.73 180 bottom
JP2  18.1,38.73 180 bottom
JP3  25.72,38.73 180 bottom
JP4  33.34,38.73 180 bottom
JP5  12.06,38.73 180 top
MPPT1:C1  10uF  [C0805]  8.26,33.97 90 bottom
MPPT1:C2  1uF  [C0603]  13.34,28.89 270 bottom
MPPT1:C3  10uF  [C0805]  11.75,17.78 0 bottom
MPPT1:C4  4.7uF  [C0603]  11.43,21.27 90 bottom
MPPT1:C5  10nF  [C0603]  7.62,21.27 90 bottom
MPPT1:IC1  LTC3105  [SOP65P490X110-12N]  9.84,27.3 90 bottom
MPPT1:L1  10uH  [CDRH3D28]  11.75,33.97 270 bottom
MPPT1:R1  75k  [R0603]  9.53,21.27 90 bottom
MPPT1:R2  1M33  [R0603]  13.34,21.27 270 bottom
MPPT1:R3  392k  [R0603]  13.34,25.72 270 bottom
MPPT2:C1  10uF  [C0805]  15.88,33.97 90 bottom
MPPT2:C2  1uF  [C0603]  20.95,28.89 270 bottom
MPPT2:C3  10uF  [C0805]  19.37,17.78 0 bottom
MPPT2:C4  4.7uF  [C0603]  19.05,21.27 90 bottom
MPPT2:C5  10nF  [C0603]  15.24,21.27 90 bottom
MPPT2:IC1  LTC3105  [SOP65P490X110-12N]  17.46,27.3 90 bottom
MPPT2:L1  10uH  [CDRH3D28]  19.37,33.97 270 bottom
MPPT2:R1  75k  [R0603]  17.14,21.27 90 bottom
MPPT2:R2  1M33  [R0603]  20.95,21.27 270 bottom
MPPT2:R3  392k  [R0603]  20.95,25.72 270 bottom
MPPT3:C1  10uF  [C0805]  23.5,33.97 90 bottom
MPPT3:C2  1uF  [C0603]  28.57,28.89 270 bottom
MPPT3:C3  10uF  [C0805]  26.99,17.78 0 bottom
MPPT3:C4  4.7uF  [C0603]  26.67,21.27 90 bottom
MPPT3:C5  10nF  [C0603]  22.86,21.27 90 bottom
MPPT3:IC1  LTC3105  [SOP65P490X110-12N]  25.08,27.3 90 bottom
MPPT3:L1  10uH  [CDRH3D28]  26.99,33.97 270 bottom
MPPT3:R1  75k  [R0603]  24.77,21.27 90 bottom
MPPT3:R2  1M33  [R0603]  28.57,21.27 270 bottom
MPPT3:R3  392k  [R0603]  28.57,25.72 270 bottom
MPPT4:C1  10uF  [C0805]  31.11,33.97 90 bottom
MPPT4:C2  1uF  [C0603]  36.2,28.89 270 bottom
MPPT4:C3  10uF  [C0805]  34.61,17.78 0 bottom
MPPT4:C4  4.7uF  [C0603]  34.29,21.27 90 bottom
MPPT4:C5  10nF  [C0603]  30.48,21.27 90 bottom
MPPT4:IC1  LTC3105  [SOP65P490X110-12N]  32.7,27.3 90 bottom
MPPT4:L1  10uH  [CDRH3D28]  34.61,33.97 270 bottom
MPPT4:R1  75k  [R0603]  32.38,21.27 90 bottom
MPPT4:R2  1M33  [R0603]  36.2,21.27 270 bottom
MPPT4:R3  392k  [R0603]  36.2,25.72 270 bottom
R8  38.73,19.68 90 top
R9  35.88,20.64 0 top
R10  35.88,18.73 0 top
R11  41.59,14.61 90 top
R12  38.73,15.56 0 top
R15  32.7,13.02 0 top
R16  32.7,11.11 0 top
R17  38.73,13.65 0 top
R18  42.23,20.64 90 top
R19  3.17,26.99 270 top
R20  6.03,26.04 180 top
R21  6.03,27.94 180 top
R22  38.73,25.08 90 top
SJ1  19.37,17.3 0 top
SMPS1:C1  10uF  [C0805]  28.26,35.24 270 top
SMPS1:C2  10uF  [C0805]  35.88,35.24 270 top
SMPS1:IC1  TPS63001  [DRC-S-PVSON-N10]  32.07,35.24 180 top
SMPS1:L1  2.2uH  [VLF4012A]  32.07,40.01 0 top
X1-BOT  22,7 0 bottom
X1-TOP  22,7 180 top

### Tracks (layer width: path | path; a pad name or v marks a point on that pad's centre or on a via)
!RST  (via drill 0.33)
  Top 0.152: IC4.1 6.99,8.21 6.99,7.3 7.3,6.99 7.3,6.53 | 7.3,6.53 v7.3,6.03 | 7.3,6.53 7.09,6.15 v7.3,6.03 | 7.3,6.53 7.51,6.15 v7.3,6.03
  Top 0.254: X1-TOP.45 21.7,3.35 | 21.7,3.35 v21.7,2.85 | 21.7,3.35 21.52,2.93 v21.7,2.85 | 21.7,3.35 21.88,2.93 v21.7,2.85
  Bottom 0.152: v7.3,6.03 7.3,5.54 | 7.3,5.54 7.3,4.45 7.78,3.97 10.64,3.97 11.59,3.02 11.59,1.75 12.06,1.27 21.43,1.27 21.7,1.54 21.7,2.36 | v21.7,2.85 21.7,2.36 | 21.7,2.36 21.91,2.74 v21.7,2.85 | 21.7,2.36 21.49,2.74 v21.7,2.85 | 7.3,5.54 7.51,5.92 v7.3,6.03 | 7.3,5.54 7.09,5.92 v7.3,6.03
  Bottom 0.254: X1-BOT.45 21.7,3.35 | 21.7,3.35 v21.7,2.85 | 21.7,3.35 21.52,2.93 v21.7,2.85 | 21.7,3.35 21.88,2.93 v21.7,2.85
+3V3  (via drill 0.3, 0.33)
  Top 0.254: v6.35,6.03 6,6.38 | 6,6.38 5.99,6.4 IC4.2 4.23,7.3 C1.1 | R11.1 41.59,13.65 R17.2 | R15.2 33.55,12.8 33.97,12.39 | 33.97,12.39 v34.29,12.06 | R16.2 33.55,11.33 33.97,11.74 | 33.97,11.74 v34.29,12.06 | 6,6.38 6.17,5.96 v6.35,6.03 | 6,6.38 6.42,6.21 v6.35,6.03 | 33.97,12.39 34.12,12 v34.29,12.06 | 33.97,12.39 34.36,12.23 v34.29,12.06 | 33.97,11.74 34.36,11.9 v34.29,12.06 | 33.97,11.74 34.12,12.13 v34.29,12.06
  Top 0.406: v41.59,10.79 41.59,11.29 | 41.59,11.29 R11.1 | 41.59,11.29 41.48,10.82 v41.59,10.79 | 41.59,11.29 41.7,10.82 v41.59,10.79
  Bottom 0.254: 25.4,1.27 24.92,0.79 11.91,0.79 11.11,1.59 11.11,2.86 10.48,3.49 7.3,3.49 6.35,4.45 6.35,5.54 | 6.35,5.54 v6.35,6.03 | v34.29,12.06 34.75,12.06 | 34.75,12.06 40.32,12.06 41.24,11.14 | 41.24,11.14 v41.59,10.79 | 6.35,5.54 6.53,5.96 v6.35,6.03 | 6.35,5.54 6.17,5.96 v6.35,6.03 | 41.24,11.14 41.42,10.72 v41.59,10.79 | 41.24,11.14 41.66,10.97 v41.59,10.79 | 34.75,12.06 34.36,12.23 v34.29,12.06 | 34.75,12.06 34.36,11.9 v34.29,12.06
  Bottom 0.406: X1-BOT.51 25.3,1.37 25.4,1.27 25.72,0.95 34.92,0.95 36.51,2.54 36.51,5.71 41.24,10.45 | 41.24,10.45 v41.59,10.79 | 41.24,10.45 41.65,10.7 v41.59,10.79 | 41.24,10.45 41.49,10.86 v41.59,10.79
  other vias: 24.9,2.85 25.7,2.85
  pour Top (no thermals): 24.6,6.03 26,6.03 26,2.54 24.6,2.54
  pour Bottom (no thermals): 24.6,6.03 26,6.03 26,2.54 24.6,2.54
+3V3_OUT
  Top 0.254: R11.2 41.59,15.56 R12.2
  Top 0.406: R11.2 41.59,17.78 40.64,18.73 40.64,23.14 IC1.1
+3V3_SW[1]  (via drill 0.33)
  Top 0.254: X1-TOP.9 25.9,10.65 | 25.9,10.65 v25.9,11.14 | 25.9,10.65 26.08,11.07 v25.9,11.14 | 25.9,10.65 25.72,11.07 v25.9,11.14
  Bottom 0.254: X1-BOT.9 25.9,10.65 | 25.9,10.65 v25.9,11.14 | 25.9,10.65 26.08,11.07 v25.9,11.14 | 25.9,10.65 25.72,11.07 v25.9,11.14
+3V3_SW[2]  (via drill 0.33)
  Top 0.254: X1-TOP.10 25.3,11.25 | 25.3,11.25 v25.3,11.75 | 25.3,11.25 25.48,11.67 v25.3,11.75 | 25.3,11.25 25.12,11.67 v25.3,11.75
  Bottom 0.254: X1-BOT.10 25.3,11.25 | 25.3,11.25 v25.3,11.75 | 25.3,11.25 25.48,11.67 v25.3,11.75 | 25.3,11.25 25.12,11.67 v25.3,11.75
+3V3_SW[3]  (via drill 0.33)
  Top 0.254: X1-TOP.11 24.7,10.65 | 24.7,10.65 v24.7,11.14 | 24.7,10.65 24.88,11.07 v24.7,11.14 | 24.7,10.65 24.52,11.07 v24.7,11.14
  Bottom 0.254: X1-BOT.11 24.7,10.65 | 24.7,10.65 v24.7,11.14 | 24.7,10.65 24.88,11.07 v24.7,11.14 | 24.7,10.65 24.52,11.07 v24.7,11.14
+3V3_UNPRO
  Top 0.305: SMPS1:IC1.1 33.07,37.2 33.34,37.47 34.92,37.47 35.24,37.78 35.24,38.42 35.56,38.73 36.2,38.73 37.47,37.47 37.47,34.29 | SMPS1:IC1.10 33.07,33.29 33.34,33.02 35.56,33.02 35.88,33.34 SMPS1:C2.2
  Top 0.406: IC1.6 40.65,27.64 41.59,28.57 41.59,33.66 40.95,34.29 37.47,34.29 SMPS1:C2.2
A0
  Top 0.152: IC3.5 19.75,18.8 19.37,18.41 SJ1.2
BMS1:BATT_PROG
  Top 0.254: BMS1:IC1.12 15.47,34.38 15.88,33.97 BMS1:R1.2
BMS1:VL
  Top 0.254: BMS1:IC1.4 9.53,33.97 9.21,33.66 BMS1:C2.2
GND  (via drill 0.3, 0.33)
  other vias: 13.65,6.99 30.48,6.99 32.07,4.45 8.89,8.26 43.18,6.35 37.47,0.95 5.4,34.61 42.55,18.41 41.59,27.3 39.37,22.86 38.1,31.75 7.94,23.5 9.21,19.05 14.92,23.81 29.84,15.88 23.81,18.1 21.91,31.43 6.35,42.86 7.3,38.42 0.95,37.47 4.45,21.27 6.99,14.29 14.92,28.26 27.62,23.81 25.4,26.67 37.78,42.86 42.86,37.47 6.99,29.84 30.16,30.8 18.1,30.8 13.97,31.43 10.48,23.34 16.83,17.78 20,23.5 21.59,15.88 28.26,38.1 35.88,37.78
  pour Top (rank 6): 44,44 0,44 0,0 44,0
  pour Bottom (rank 6): 44,44 0,44 0,0 44,0
  pour Bottom (rank 4, no thermals): 11.75,12.7 31.75,12.7 31.75,0.95 11.75,0.95
  pour Top (rank 4, no thermals): 11.75,12.7 31.75,12.7 31.75,0.95 11.75,0.95
  pour Bottom (rank 4, no thermals): 2.22,18.1 2.22,10.48 6.99,10.48 6.99,18.1
  pour Top (rank 2, no thermals): 17.78,25.72 24.13,25.72 24.13,19.37 17.78,19.37
GPIO[1]  (via drill 0.33)
  Top 0.254: X1-TOP.19 19.9,10.65 | 19.9,10.65 v19.9,11.14 | 19.9,10.65 20.08,11.07 v19.9,11.14 | 19.9,10.65 19.72,11.07 v19.9,11.14
  Bottom 0.254: X1-BOT.19 19.9,10.65 | 19.9,10.65 v19.9,11.14 | 19.9,10.65 20.08,11.07 v19.9,11.14 | 19.9,10.65 19.72,11.07 v19.9,11.14
GPIO[2]  (via drill 0.33)
  Top 0.254: X1-TOP.20 19.3,11.25 | 19.3,11.25 v19.3,11.75 | 19.3,11.25 19.48,11.67 v19.3,11.75 | 19.3,11.25 19.12,11.67 v19.3,11.75
  Bottom 0.254: X1-BOT.20 19.3,11.25 | 19.3,11.25 v19.3,11.75 | 19.3,11.25 19.48,11.67 v19.3,11.75 | 19.3,11.25 19.12,11.67 v19.3,11.75
GPIO[3]  (via drill 0.33)
  Top 0.254: X1-TOP.21 18.7,10.65 | 18.7,10.65 v18.7,11.14 | 18.7,10.65 18.88,11.07 v18.7,11.14 | 18.7,10.65 18.52,11.07 v18.7,11.14
  Bottom 0.254: X1-BOT.21 18.7,10.65 | 18.7,10.65 v18.7,11.14 | 18.7,10.65 18.88,11.07 v18.7,11.14 | 18.7,10.65 18.52,11.07 v18.7,11.14
GPIO[4]  (via drill 0.33)
  Top 0.254: X1-TOP.23 17.5,10.65 | 17.5,10.65 v17.5,11.14 | 17.5,10.65 17.68,11.07 v17.5,11.14 | 17.5,10.65 17.32,11.07 v17.5,11.14
  Bottom 0.254: X1-BOT.23 17.5,10.65 | 17.5,10.65 v17.5,11.14 | 17.5,10.65 17.68,11.07 v17.5,11.14 | 17.5,10.65 17.32,11.07 v17.5,11.14
GPIO[5]  (via drill 0.33)
  Top 0.254: X1-TOP.24 16.9,11.25 | 16.9,11.25 v16.9,11.75 | 16.9,11.25 17.08,11.67 v16.9,11.75 | 16.9,11.25 16.72,11.67 v16.9,11.75
  Bottom 0.254: X1-BOT.24 16.9,11.25 | 16.9,11.25 v16.9,11.75 | 16.9,11.25 17.08,11.67 v16.9,11.75 | 16.9,11.25 16.72,11.67 v16.9,11.75
GPIO[6]  (via drill 0.33)
  Top 0.254: X1-TOP.25 16.3,10.65 | 16.3,10.65 v16.3,11.14 | 16.3,10.65 16.48,11.07 v16.3,11.14 | 16.3,10.65 16.12,11.07 v16.3,11.14
  Bottom 0.254: X1-BOT.25 16.3,10.65 | 16.3,10.65 v16.3,11.14 | 16.3,10.65 16.48,11.07 v16.3,11.14 | 16.3,10.65 16.12,11.07 v16.3,11.14
GPIO[7]  (via drill 0.33)
  Top 0.254: X1-TOP.27 15.1,10.65 | 15.1,10.65 v15.1,11.14 | 15.1,10.65 15.28,11.07 v15.1,11.14 | 15.1,10.65 14.92,11.07 v15.1,11.14
  Bottom 0.254: X1-BOT.27 15.1,10.65 | 15.1,10.65 v15.1,11.14 | 15.1,10.65 15.28,11.07 v15.1,11.14 | 15.1,10.65 14.92,11.07 v15.1,11.14
GPIO[8]  (via drill 0.33)
  Top 0.254: X1-TOP.28 14.5,11.25 | 14.5,11.25 v14.5,11.75 | 14.5,11.25 14.68,11.67 v14.5,11.75 | 14.5,11.25 14.32,11.67 v14.5,11.75
  Bottom 0.254: X1-BOT.28 14.5,11.25 | 14.5,11.25 v14.5,11.75 | 14.5,11.25 14.68,11.67 v14.5,11.75 | 14.5,11.25 14.32,11.67 v14.5,11.75
GPIO[9]  (via drill 0.33)
  Top 0.254: X1-TOP.29 13.9,10.65 | 13.9,10.65 v13.9,11.14 | 13.9,10.65 14.08,11.07 v13.9,11.14 | 13.9,10.65 13.72,11.07 v13.9,11.14
  Bottom 0.254: X1-BOT.29 13.9,10.65 | 13.9,10.65 v13.9,11.14 | 13.9,10.65 14.08,11.07 v13.9,11.14 | 13.9,10.65 13.72,11.07 v13.9,11.14
GPIO[10]  (via drill 0.33)
  Top 0.254: X1-TOP.31 13.3,3.35 | 13.3,3.35 v13.3,2.85 | 13.3,3.35 13.12,2.93 v13.3,2.85 | 13.3,3.35 13.48,2.93 v13.3,2.85
  Bottom 0.254: X1-BOT.31 13.3,3.35 | 13.3,3.35 v13.3,2.85 | 13.3,3.35 13.12,2.93 v13.3,2.85 | 13.3,3.35 13.48,2.93 v13.3,2.85
GPIO[11]  (via drill 0.33)
  Top 0.254: X1-TOP.32 13.9,2.75 | 13.9,2.75 v13.9,2.25 | 13.9,2.75 13.72,2.33 v13.9,2.25 | 13.9,2.75 14.08,2.33 v13.9,2.25
  Bottom 0.254: X1-BOT.32 13.9,2.75 | 13.9,2.75 v13.9,2.25 | 13.9,2.75 13.72,2.33 v13.9,2.25 | 13.9,2.75 14.08,2.33 v13.9,2.25
GPIO[12]  (via drill 0.33)
  Top 0.254: X1-TOP.38 17.5,3.35 | 17.5,3.35 v17.5,2.85 | 17.5,3.35 17.32,2.93 v17.5,2.85 | 17.5,3.35 17.68,2.93 v17.5,2.85
  Bottom 0.254: X1-BOT.38 17.5,3.35 | 17.5,3.35 v17.5,2.85 | 17.5,3.35 17.32,2.93 v17.5,2.85 | 17.5,3.35 17.68,2.93 v17.5,2.85
GPIO[13]  (via drill 0.33)
  Top 0.254: X1-TOP.39 18.1,2.75 | 18.1,2.75 v18.1,2.25 | 18.1,2.75 17.92,2.33 v18.1,2.25 | 18.1,2.75 18.28,2.33 v18.1,2.25
  Bottom 0.254: X1-BOT.39 18.1,2.75 | 18.1,2.75 v18.1,2.25 | 18.1,2.75 17.92,2.33 v18.1,2.25 | 18.1,2.75 18.28,2.33 v18.1,2.25
GPIO[14]  (via drill 0.33)
  Top 0.254: X1-TOP.40 18.7,3.35 | 18.7,3.35 v18.7,2.85 | 18.7,3.35 18.52,2.93 v18.7,2.85 | 18.7,3.35 18.88,2.93 v18.7,2.85
  Bottom 0.254: X1-BOT.40 18.7,3.35 | 18.7,3.35 v18.7,2.85 | 18.7,3.35 18.52,2.93 v18.7,2.85 | 18.7,3.35 18.88,2.93 v18.7,2.85
I2C_SCL  (via drill 0.33)
  Top 0.152: v30.1,11.14 30.1,11.64 | 30.1,11.64 30.1,12.13 26.99,15.24 24.13,15.24 20.55,18.82 IC3.6 | R16.1 31.82,11.14 30.59,11.14 | 30.59,11.14 v30.1,11.14 | 30.1,11.64 29.89,11.26 v30.1,11.14 | 30.1,11.64 30.31,11.26 v30.1,11.14 | 30.59,11.14 30.22,11.36 v30.1,11.14 | 30.59,11.14 30.22,10.93 v30.1,11.14
  Top 0.254: X1-TOP.2 30.1,10.65 | 30.1,10.65 v30.1,11.14 | 30.1,10.65 30.28,11.07 v30.1,11.14 | 30.1,10.65 29.92,11.07 v30.1,11.14
  Bottom 0.254: X1-BOT.2 30.1,10.65 | 30.1,10.65 v30.1,11.14 | 30.1,10.65 30.28,11.07 v30.1,11.14 | 30.1,10.65 29.92,11.07 v30.1,11.14
I2C_SDA  (via drill 0.33)
  Top 0.152: v30,13.18 29.64,13.52 | 29.64,13.52 27.46,15.56 24.29,15.56 21.36,18.49 IC3.7 | v30,13.18 30.5,13.18 | 30.5,13.18 31.69,13.18 arc-90 R15.1 | 29.64,13.52 29.77,13.1 v30,13.18 | 29.64,13.52 30.06,13.41 v30,13.18 | 30.5,13.18 30.12,13.39 v30,13.18 | 30.5,13.18 30.12,12.97 v30,13.18
  Top 0.254: X1-TOP.4 28.9,10.65 | 28.9,10.65 v28.9,11.14 | 28.9,10.65 29.08,11.07 v28.9,11.14 | 28.9,10.65 28.72,11.07 v28.9,11.14
  Bottom 0.152: v28.9,11.14 28.9,11.64 | 28.9,11.64 28.9,12.07 29.65,12.83 | 29.65,12.83 v30,13.18 | 28.9,11.64 28.69,11.26 v28.9,11.14 | 28.9,11.64 29.11,11.26 v28.9,11.14 | 29.65,12.83 30.07,12.94 v30,13.18 | 29.65,12.83 29.77,13.24 v30,13.18
  Bottom 0.254: X1-BOT.4 28.9,10.65 | 28.9,10.65 v28.9,11.14 | 28.9,10.65 29.08,11.07 v28.9,11.14 | 28.9,10.65 28.72,11.07 v28.9,11.14
ILIMIT_3V3
  Top 0.254: IC1.2 41.59,22.12 R18.2
ILIMIT_VBUS
  Top 0.254: IC2.2 38.1,26.57 R22.2
IN1_N
  Top 0.254: R17.1 36.3,13.65 C10.2 35.58,13.76 34.92,14.41 33.26,14.41 27.75,19.92 27.75,22.15 26.75,23.15 23.97,23.15 23.77,22.94 IC3.11
IN1_P
  Top 0.254: R12.1 36.3,15.56 C10.1 35.58,15.46 34.92,14.8 33.42,14.8 28.13,20.08 28.13,22.3 26.91,23.53 23.97,23.53 23.76,23.74 IC3.12
IN2_N
  Top 0.254: R10.1 33.34,18.73 C9.2 32.73,18.84 32.07,19.49 30.4,19.49 29.02,20.88 29.02,25 26.27,27.75 21.67,27.75 21.14,27.23 21.14,25.72 21.36,25.51 IC3.14
IN2_P
  Top 0.254: R9.1 33.34,20.64 C9.1 32.73,20.54 32.07,19.88 30.56,19.88 29.4,21.03 29.4,25.16 26.43,28.13 21.51,28.13 20.77,27.38 20.77,25.72 20.55,25.51 IC3.15
IN3_N
  Top 0.254: R21.1 8.47,27.94 C17.2 9.18,27.84 9.84,27.18 14.37,27.18 17.8,23.74 IC3.1
IN3_P
  Top 0.254: R20.1 8.47,26.04 C17.1 9.18,26.14 9.84,26.8 14.21,26.8 18.06,22.94 IC3.2
MPPT1:AUX
  Bottom 0.254: MPPT1:IC1.12 11.47,29.74 MPPT1:C2.1
MPPT1:FB
  Bottom 0.254: MPPT1:IC1.1 11.47,24.87 MPPT1:R3.2 MPPT1:R2.1
MPPT1:LDO
  Bottom 0.254: MPPT1:IC1.2 10.81,24.12 11.43,23.5 MPPT1:C4.2
MPPT1:MPPC
  Bottom 0.254: MPPT1:IC1.5 8.88,24.14 9.53,23.5 MPPT1:R1.2
MPPT1:SW
  Bottom 0.254: MPPT1:IC1.9 9.51,31.1 10.53,32.12 MPPT1:L1.2
MPPT2:AUX
  Bottom 0.254: MPPT2:IC1.12 19.09,29.74 MPPT2:C2.1
MPPT2:FB
  Bottom 0.254: MPPT2:IC1.1 19.09,24.87 MPPT2:R3.2 MPPT2:R2.1
MPPT2:LDO
  Bottom 0.254: MPPT2:IC1.2 18.43,24.12 19.05,23.5 MPPT2:C4.2
MPPT2:MPPC
  Bottom 0.254: MPPT2:IC1.5 16.5,24.14 17.14,23.5 MPPT2:R1.2
MPPT2:SW
  Bottom 0.254: MPPT2:IC1.9 17.13,31.1 18.15,32.12 MPPT2:L1.2
MPPT3:AUX
  Bottom 0.254: MPPT3:IC1.12 26.71,29.74 MPPT3:C2.1
MPPT3:FB
  Bottom 0.254: MPPT3:IC1.1 26.71,24.87 MPPT3:R3.2 MPPT3:R2.1
MPPT3:LDO
  Bottom 0.254: MPPT3:IC1.2 26.05,24.12 26.67,23.5 MPPT3:C4.2
MPPT3:MPPC
  Bottom 0.254: MPPT3:IC1.5 24.12,24.14 24.77,23.5 MPPT3:R1.2
MPPT3:SW
  Bottom 0.254: MPPT3:IC1.9 24.75,31.1 25.77,32.12 MPPT3:L1.2
MPPT4:AUX
  Bottom 0.254: MPPT4:IC1.12 34.33,29.74 MPPT4:C2.1
MPPT4:FB
  Bottom 0.254: MPPT4:IC1.1 34.33,24.87 MPPT4:R3.2 MPPT4:R2.1
MPPT4:LDO
  Bottom 0.254: MPPT4:IC1.2 33.67,24.12 34.29,23.5 MPPT4:C4.2
MPPT4:MPPC
  Bottom 0.254: MPPT4:IC1.5 31.74,24.14 32.38,23.5 MPPT4:R1.2
MPPT4:SW
  Bottom 0.254: MPPT4:IC1.9 32.37,31.1 33.39,32.12 MPPT4:L1.2
NC@34  (via drill 0.33)
  Top 0.254: v15.1,2.85 15.1,3.35 | 15.1,3.35 X1-TOP.34 | 15.1,3.35 14.92,2.93 v15.1,2.85 | 15.1,3.35 15.28,2.93 v15.1,2.85
  Bottom 0.254: X1-BOT.34 15.1,3.35 | 15.1,3.35 v15.1,2.85 | 15.1,3.35 14.92,2.93 v15.1,2.85 | 15.1,3.35 15.28,2.93 v15.1,2.85
NC@35  (via drill 0.33)
  Top 0.254: v15.7,2.25 15.7,2.75 | 15.7,2.75 X1-TOP.35 | 15.7,2.75 15.52,2.33 v15.7,2.25 | 15.7,2.75 15.88,2.33 v15.7,2.25
  Bottom 0.254: X1-BOT.35 15.7,2.75 | 15.7,2.75 v15.7,2.25 | 15.7,2.75 15.52,2.33 v15.7,2.25 | 15.7,2.75 15.88,2.33 v15.7,2.25
NC@36  (via drill 0.33)
  Top 0.254: v16.3,2.85 16.3,3.35 | 16.3,3.35 X1-TOP.36 | 16.3,3.35 16.12,2.93 v16.3,2.85 | 16.3,3.35 16.48,2.93 v16.3,2.85
  Bottom 0.254: X1-BOT.36 16.3,3.35 | 16.3,3.35 v16.3,2.85 | 16.3,3.35 16.12,2.93 v16.3,2.85 | 16.3,3.35 16.48,2.93 v16.3,2.85
NC@42  (via drill 0.33)
  Top 0.254: v19.9,2.85 19.9,3.35 | 19.9,3.35 X1-TOP.42 | 19.9,3.35 19.72,2.93 v19.9,2.85 | 19.9,3.35 20.08,2.93 v19.9,2.85
  Bottom 0.254: X1-BOT.42 19.9,3.35 | 19.9,3.35 v19.9,2.85 | 19.9,3.35 19.72,2.93 v19.9,2.85 | 19.9,3.35 20.08,2.93 v19.9,2.85
NC@43  (via drill 0.33)
  Top 0.254: v20.5,2.25 20.5,2.75 | 20.5,2.75 X1-TOP.43 | 20.5,2.75 20.32,2.33 v20.5,2.25 | 20.5,2.75 20.68,2.33 v20.5,2.25
  Bottom 0.254: X1-BOT.43 20.5,2.75 | 20.5,2.75 v20.5,2.25 | 20.5,2.75 20.32,2.33 v20.5,2.25 | 20.5,2.75 20.68,2.33 v20.5,2.25
NC@56  (via drill 0.33)
  Top 0.254: X1-TOP.56 28.3,2.75 | 28.3,2.75 v28.3,2.25 | 28.3,2.75 28.12,2.33 v28.3,2.25 | 28.3,2.75 28.48,2.33 v28.3,2.25
  Bottom 0.254: v28.3,2.25 28.3,2.75 | 28.3,2.75 X1-BOT.56 | 28.3,2.75 28.12,2.33 v28.3,2.25 | 28.3,2.75 28.48,2.33 v28.3,2.25
S_ARRAY_1
  Bottom 0.254: MPPT1:IC1.11 10.81,27.29 12.38,25.72 14.13,25.72 14.29,25.56 14.29,20.64 14.07,20.42 MPPT1:R2.2 13.34,18.42 MPPT1:C3.1 12.7,16.67 12.54,16.51 9.21,16.51 8.53,17.18 IDIODE1:IC1.1
S_ARRAY_2
  Bottom 0.254: MPPT2:IC1.11 18.43,27.29 20,25.72 21.75,25.72 21.91,25.56 21.91,20.64 21.69,20.42 MPPT2:R2.2 20.95,18.42 MPPT2:C3.1 20.32,16.19 20,15.88 9.21,15.88 8.53,15.2 IDIODE1:IC1.5
S_ARRAY_3
  Bottom 0.254: MPPT3:IC1.11 26.05,27.29 27.62,25.72 29.37,25.72 29.53,25.56 29.53,20.64 29.31,20.42 MPPT3:R2.2 28.57,20.32 27.62,19.37 27.62,18.1 MPPT3:C3.1 27.94,15.87 26.99,14.92 9.53,14.92 7.98,13.37 IDIODE1:IC2.1
S_ARRAY_4
  Bottom 0.254: MPPT4:IC1.11 33.67,27.29 35.24,25.72 36.99,25.72 37.15,25.56 37.15,20.64 36.93,20.42 MPPT4:R2.2 36.2,18.42 MPPT4:C3.1 35.56,16.19 35.24,15.88 33.02,15.88 31.11,13.97 9.84,13.97 7.26,11.39 IDIODE1:IC2.5
SMPS1:N$1
  Top 0.406: SMPS1:IC1.4 31.57,37.65 30.16,39.05 SMPS1:L1.P$1
  pour Top (no thermals): 31.59,37.47 31.59,40.96 29.53,40.96 29.53,39.37 31.43,37.47
SMPS1:N$2
  Top 0.406: SMPS1:IC1.2 32.57,37.65 33.97,39.05 SMPS1:L1.P$2
  pour Top (no thermals): 32.54,37.47 32.54,40.96 34.61,40.96 34.61,39.37 32.7,37.47
SOLAR_1
  Bottom 0.254: MPPT1:C1.1
  Bottom 0.305: MPPT1:IC1.8 8.88,31.13 8.26,31.75 MPPT1:C1.1 9.21,33.02 9.53,33.34 9.53,34.92 10.52,35.92 MPPT1:L1.1 11.76,37.14 11.48,37.42 JP1.3
SOLAR_2
  Bottom 0.305: MPPT2:IC1.8 16.5,31.13 15.88,31.75 MPPT2:C1.1 16.83,33.02 17.14,33.34 17.14,34.92 18.14,35.92 MPPT2:L1.1 19.38,37.14 19.1,37.42 JP2.3
SOLAR_3
  Bottom 0.305: MPPT3:IC1.8 24.12,31.13 23.5,31.75 MPPT3:C1.1 24.45,33.02 24.77,33.34 24.77,34.92 25.76,35.92 MPPT3:L1.1 26.99,37.14 26.72,37.42 JP3.3
SOLAR_4
  Bottom 0.305: MPPT4:IC1.8 31.74,31.13 31.11,31.75 MPPT4:C1.1 32.07,33.02 32.38,33.34 32.38,34.92 33.38,35.92 MPPT4:L1.1 34.61,37.14 34.34,37.42 JP4.3
SPI_CS  (via drill 0.33)
  Top 0.254: X1-TOP.47 22.9,3.35 | 22.9,3.35 v22.9,2.85 | 22.9,3.35 22.72,2.93 v22.9,2.85 | 22.9,3.35 23.08,2.93 v22.9,2.85
  Bottom 0.254: X1-BOT.47 22.9,3.35 | 22.9,3.35 v22.9,2.85 | 22.9,3.35 22.72,2.93 v22.9,2.85 | 22.9,3.35 23.08,2.93 v22.9,2.85
SPI_MISO  (via drill 0.33)
  Top 0.254: X1-TOP.15 22.3,10.65 | 22.3,10.65 v22.3,11.14 | 22.3,10.65 22.48,11.07 v22.3,11.14 | 22.3,10.65 22.12,11.07 v22.3,11.14
  Bottom 0.254: X1-BOT.15 22.3,10.65 | 22.3,10.65 v22.3,11.14 | 22.3,10.65 22.48,11.07 v22.3,11.14 | 22.3,10.65 22.12,11.07 v22.3,11.14
SPI_MOSI  (via drill 0.33)
  Top 0.254: X1-TOP.17 21.1,10.65 | 21.1,10.65 v21.1,11.14 | 21.1,10.65 21.28,11.07 v21.1,11.14 | 21.1,10.65 20.92,11.07 v21.1,11.14
  Bottom 0.254: X1-BOT.17 21.1,10.65 | 21.1,10.65 v21.1,11.14 | 21.1,10.65 21.28,11.07 v21.1,11.14 | 21.1,10.65 20.92,11.07 v21.1,11.14
SPI_SCK  (via drill 0.33)
  Top 0.254: X1-TOP.13 23.5,10.65 | 23.5,10.65 23.5,11.11 v23.5,11.14 | 23.5,10.65 23.67,11.07 v23.5,11.14 | 23.5,10.65 23.32,11.07 v23.5,11.14
  Bottom 0.254: X1-BOT.13 23.5,10.65 | 23.5,10.65 23.5,11.11 v23.5,11.14 | 23.5,10.65 23.67,11.07 v23.5,11.14 | 23.5,10.65 23.32,11.07 v23.5,11.14
TA1  (via drill 0.3)
  Top 0.152: 7.16,19.37 6.67,19.37 5.4,20.64 5.4,23.48 | 7.16,19.37 v7.62,19.37 | v5.71,23.81 5.4,23.5 5.4,23.48 | 7.16,19.37 7.51,19.17 v7.62,19.37 | 7.16,19.37 7.51,19.57 v7.62,19.37 | 5.4,23.48 5.78,23.59 v5.71,23.81 | 5.4,23.48 5.49,23.87 v5.71,23.81
  Bottom 0.152: 5.71,24.27 5.71,31.75 4.45,33.02 4.45,34.92 3.81,35.56 3.81,35.88 8.26,40.32 10.16,40.32 10.48,40.01 JP1.2 | 5.71,24.27 v5.71,23.81 | v7.62,19.37 7.62,19.82 | 7.62,19.82 MPPT1:C5.1 | 7.62,19.82 7.42,19.48 v7.62,19.37 | 7.62,19.82 7.82,19.48 v7.62,19.37 | 5.71,24.27 5.52,23.93 v5.71,23.81 | 5.71,24.27 5.91,23.93 v5.71,23.81
  Bottom 0.254: MPPT1:R1.1 MPPT1:C5.1
TA2  (via drill 0.3)
  Top 0.152: v16.19,19.05 15.87,18.73 | 15.87,18.73 15.24,18.1 6.67,18.1 5.08,19.68 5.08,23.99 | 5.08,23.99 v5.08,24.45 | 15.87,18.73 16.25,18.83 v16.19,19.05 | 15.87,18.73 15.97,19.11 v16.19,19.05 | 5.08,23.99 5.28,24.33 v5.08,24.45 | 5.08,23.99 4.88,24.33 v5.08,24.45
  Bottom 0.152: MPPT2:R1.1 17.14,19.37 16.83,19.05 16.65,19.05 | 16.65,19.05 v16.19,19.05 | v5.08,24.45 5.4,24.77 5.4,24.78 | 5.4,24.78 5.4,31.43 4.13,32.7 4.13,34.77 3.49,35.4 3.49,36.04 8.26,40.8 17.46,40.8 18.1,40.16 JP2.2 | 16.65,19.05 16.31,19.25 v16.19,19.05 | 16.65,19.05 16.31,18.85 v16.19,19.05 | 5.4,24.78 5.02,24.67 v5.08,24.45 | 5.4,24.78 5.3,24.39 v5.08,24.45
  Bottom 0.254: MPPT2:R1.1 MPPT2:C5.1
TA3  (via drill 0.3)
  Top 0.152: v29.21,17.46 28.89,17.79 | 28.89,17.79 27.62,19.05 25.09,19.05 | 25.09,19.05 25.08,19.05 v24.77,19.37 | v36.83,16.51 36.37,16.51 | 36.37,16.51 32.7,16.51 30.8,18.41 | 30.8,18.41 v30.48,18.73 | 36.37,16.51 36.72,16.31 v36.83,16.51 | 36.37,16.51 36.72,16.71 v36.83,16.51 | 30.8,18.41 30.7,18.79 v30.48,18.73 | 30.8,18.41 30.42,18.51 v30.48,18.73 | 28.89,17.79 28.99,17.4 v29.21,17.46 | 28.89,17.79 29.27,17.68 v29.21,17.46 | 25.09,19.05 24.98,19.43 v24.77,19.37 | 25.09,19.05 24.71,19.15 v24.77,19.37
  Bottom 0.152: JP3.2 25.72,39.69 26.35,40.32 36.2,40.32 40.32,36.2 40.32,17.3 39.85,16.83 38.1,16.83 37.78,16.51 37.29,16.51 | 37.29,16.51 v36.83,16.51 | v30.48,18.73 30.16,18.41 | 30.16,18.41 29.53,17.79 | 29.53,17.79 v29.21,17.46 | v24.77,19.37 24.77,19.82 | 24.77,19.82 MPPT3:R1.1 | 37.29,16.51 36.94,16.71 v36.83,16.51 | 37.29,16.51 36.94,16.31 v36.83,16.51 | 30.16,18.41 30.54,18.51 v30.48,18.73 | 30.16,18.41 30.26,18.79 v30.48,18.73 | 29.53,17.79 29.15,17.68 v29.21,17.46 | 29.53,17.79 29.43,17.4 v29.21,17.46 | 24.77,19.82 24.57,19.48 v24.77,19.37 | 24.77,19.82 24.96,19.48 v24.77,19.37
  Bottom 0.254: MPPT3:R1.1 MPPT3:C5.1
TA4  (via drill 0.3)
  Top 0.152: v37.47,17.14 37.01,17.14 | 37.01,17.14 33.02,17.14 31.76,18.41 | 31.76,18.41 v31.43,18.73 | 37.01,17.14 37.35,16.95 v37.47,17.14 | 37.01,17.14 37.35,17.34 v37.47,17.14 | 31.76,18.41 31.65,18.79 v31.43,18.73 | 31.76,18.41 31.37,18.51 v31.43,18.73
  Bottom 0.152: 37.92,17.14 39.69,17.14 40.01,17.46 40.01,36.04 36.04,40.01 33.66,40.01 33.34,39.69 JP4.2 | 37.92,17.14 v37.47,17.14 | v31.43,18.73 31.43,19.19 | 31.43,19.19 31.43,20.42 | 37.92,17.14 37.58,17.34 v37.47,17.14 | 37.92,17.14 37.58,16.95 v37.47,17.14 | 31.43,19.19 31.23,18.85 v31.43,18.73 | 31.43,19.19 31.63,18.85 v31.43,18.73
  Bottom 0.254: MPPT4:R1.1 31.43,20.42 MPPT4:C5.1
THM
  Top 0.254: JP5.2 12.06,39.69 11.75,40.01 10.48,40.01 10.16,39.69 10.16,38.1 9.53,37.47 7.94,37.47 7.62,37.15 7.62,33.02 7.94,32.7 9.21,32.7 9.53,33.02 9.53,33.34 9.75,33.57 BMS1:IC1.5
USB_N  (via drill 0.33)
  Top 0.152: X1-TOP.58 29.5,3.35 | 29.5,3.35 v29.5,2.85 | 29.5,3.35 29.29,2.97 v29.5,2.85 | 29.5,3.35 29.71,2.97 v29.5,2.85
  Bottom 0.152: X1-BOT.58 29.5,3.35 | 29.5,3.35 v29.5,2.85 | 29.5,3.35 29.29,2.97 v29.5,2.85 | 29.5,3.35 29.71,2.97 v29.5,2.85
USB_P  (via drill 0.33)
  Top 0.152: X1-TOP.60 30.7,3.35 | 30.7,3.35 v30.7,2.85 | 30.7,3.35 30.49,2.97 v30.7,2.85 | 30.7,3.35 30.91,2.97 v30.7,2.85
  Bottom 0.152: X1-BOT.60 30.7,3.35 | 30.7,3.35 v30.7,2.85 | 30.7,3.35 30.49,2.97 v30.7,2.85 | 30.7,3.35 30.91,2.97 v30.7,2.85
VBAT
  Top 0.254: BMS1:IC1.2 BMS1:IC1.1
  Top 0.406: JP5.3 11.06,36.47 10.57,35.97 BMS1:IC1.1
VBUS  (via drill 0.33)
  Top 0.254: R10.2 38.73,18.73 R8.1
  Top 0.406: X1-BOT.54 27.1,1.79 27.62,1.27 34.61,1.27 36.2,2.86 36.2,6.03 38.73,8.57 R8.1
  other vias: 27.5,2.85 26.7,2.85
  pour Bottom (no thermals): 26.4,6.03 27.8,6.03 27.8,2.54 26.4,2.54
  pour Top (no thermals): 26.4,6.03 27.8,6.03 27.8,2.54 26.4,2.54
VBUS_OUT
  Top 0.254: R9.2 38.73,20.64 R8.2
  Top 0.406: IC2.1 37.16,23.8 38.73,22.23 R8.2
VBUS_SW[1]  (via drill 0.33)
  Top 0.254: X1-TOP.6 27.7,11.25 | 27.7,11.25 v27.7,11.75 | 27.7,11.25 27.88,11.67 v27.7,11.75 | 27.7,11.25 27.52,11.67 v27.7,11.75
  Bottom 0.254: X1-BOT.6 27.7,11.25 | 27.7,11.25 v27.7,11.75 | 27.7,11.25 27.88,11.67 v27.7,11.75 | 27.7,11.25 27.52,11.67 v27.7,11.75
VBUS_SW[2]  (via drill 0.33)
  Top 0.254: X1-TOP.7 27.1,10.65 | 27.1,10.65 v27.1,11.14 | 27.1,10.65 27.28,11.07 v27.1,11.14 | 27.1,10.65 26.92,11.07 v27.1,11.14
  Bottom 0.254: X1-BOT.7 27.1,10.65 | 27.1,10.65 v27.1,11.14 | 27.1,10.65 27.28,11.07 v27.1,11.14 | 27.1,10.65 26.92,11.07 v27.1,11.14
VBUS_SW[3]  (via drill 0.33)
  Top 0.254: X1-TOP.8 26.5,11.25 | 26.5,11.25 v26.5,11.75 | 26.5,11.25 26.68,11.67 v26.5,11.75 | 26.5,11.25 26.32,11.67 v26.5,11.75
  Bottom 0.254: X1-BOT.8 26.5,11.25 | 26.5,11.25 v26.5,11.75 | 26.5,11.25 26.68,11.67 v26.5,11.75 | 26.5,11.25 26.32,11.67 v26.5,11.75
VSOL  (via drill 0.33)
  Top 0.152: 3.64,26.04 R19.2
  Top 0.254: R20.2 3.64,26.04
  Top 0.406: R19.2 3.17,23.56 | 3.17,23.56 3.17,23.5 v2.86,23.18 | 3.17,23.56 2.79,23.27 v2.86,23.18 | 3.17,23.56 2.96,23.13 v2.86,23.18
  Bottom 0.305: IDIODE1:IC2.6 1.94,11.39 1.59,11.75 1.59,13.34 1.63,13.37 IDIODE1:IC2.10 | IDIODE1:IC1.6 1.63,15.2 1.59,15.24 | IDIODE1:IC1.10 1.63,17.18 1.59,17.14
  Bottom 0.406: 1.59,19.37 1.59,21.91 2.51,22.83 | 1.59,19.37 1.59,17.14 1.59,15.24 1.59,13.34 | v2.86,23.18 2.51,22.83 | IDIODE1:C4.1 1.59,19.37 | 2.51,22.83 2.92,23.08 v2.86,23.18 | 2.51,22.83 2.76,23.24 v2.86,23.18
VSOL_SEN  (via drill 0.3)
  Top 0.152: 3.64,27.94 R19.1
  Top 0.254: BMS1:IC1.3 9.65,34.38 BMS1:C1.2 | R21.2 3.64,27.94
  Top 0.406: R19.1 3.17,34.29 5.39,36.51 | 5.39,36.51 v5.71,36.83 | v8.57,36.51 8.57,36.05 | 8.57,36.05 8.57,35.66 BMS1:C1.2 | 5.39,36.51 5.77,36.74 v5.71,36.83 | 5.39,36.51 5.63,36.88 v5.71,36.83 | 8.57,36.05 8.67,36.49 v8.57,36.51 | 8.57,36.05 8.47,36.49 v8.57,36.51
  Bottom 0.406: v5.71,36.83 6.17,36.83 | 6.17,36.83 8.24,36.83 | 8.24,36.83 8.26,36.83 v8.57,36.51 | 6.17,36.83 5.74,36.93 v5.71,36.83 | 6.17,36.83 5.74,36.73 v5.71,36.83 | 8.24,36.83 8.49,36.46 v8.57,36.51 | 8.24,36.83 8.62,36.6 v8.57,36.51
VSYS
  Top 0.254: BMS1:IC1.14 BMS1:IC1.13 13.56,34.84 13.65,34.92
  Top 0.406: CN1.1 20.14,36.65 19.05,35.56 14.92,35.56 14.29,34.92 13.65,34.92 13.49,34.92
VSYS_SW  (via drill 0.3)
  Top 0.152: 17.14,20.64 17.14,19.68 18.55,18.27 SJ1.1
  Top 0.254: 21.91,35.88 19.75,33.73 19.75,29.53 | 19.75,29.53 14.29,29.53 12.06,31.75 6.99,31.75 6.03,30.8 6.03,24.77 6.67,24.13 6.67,21.59 7.52,20.74 C2.1 16.3,20.64 17.14,20.64 17.85,21.34 IC3.4 | IC3.16 19.75,29.53
  Top 0.305: SMPS1:IC1.5 31.07,37.2 30.8,37.47 29.98,37.47 | 29.98,37.47 v29.53,37.47 | SMPS1:IC1.6 31.07,33.07 31.11,33.02 | SMPS1:IC1.7 31.57,33.02 | SMPS1:IC1.8 32.07,33.02 | 29.98,37.47 29.58,37.61 v29.53,37.47 | 29.98,37.47 29.58,37.32 v29.53,37.47
  Top 0.406: 29.98,33.02 31.11,33.02 31.57,33.02 32.07,33.02 32.07,32.07 33.95,30.19 IC2.6 | 29.98,33.02 v29.53,33.02 | v29.53,33.02 29.07,33.02 | 29.07,33.02 28.57,33.02 28.26,33.34 SMPS1:C1.2 23.49,34.29 21.91,35.88 21.14,36.65 CN1.2 | 29.98,33.02 29.55,33.12 v29.53,33.02 | 29.98,33.02 29.55,32.92 v29.53,33.02 | 29.07,33.02 29.5,32.92 v29.53,33.02 | 29.07,33.02 29.5,33.12 v29.53,33.02
  Bottom 0.406: v29.53,37.47 29.53,37.01 | 29.53,37.01 29.53,33.48 | 29.53,33.48 v29.53,33.02 | 29.53,37.01 29.63,37.44 v29.53,37.47 | 29.53,37.01 29.43,37.44 v29.53,37.47 | 29.53,33.48 29.43,33.04 v29.53,33.02 | 29.53,33.48 29.63,33.04 v29.53,33.02

### Text on the board
Top: Top
Bottom: Bot